# EAGLE schematic haccess (EAGLE 9.6.2)
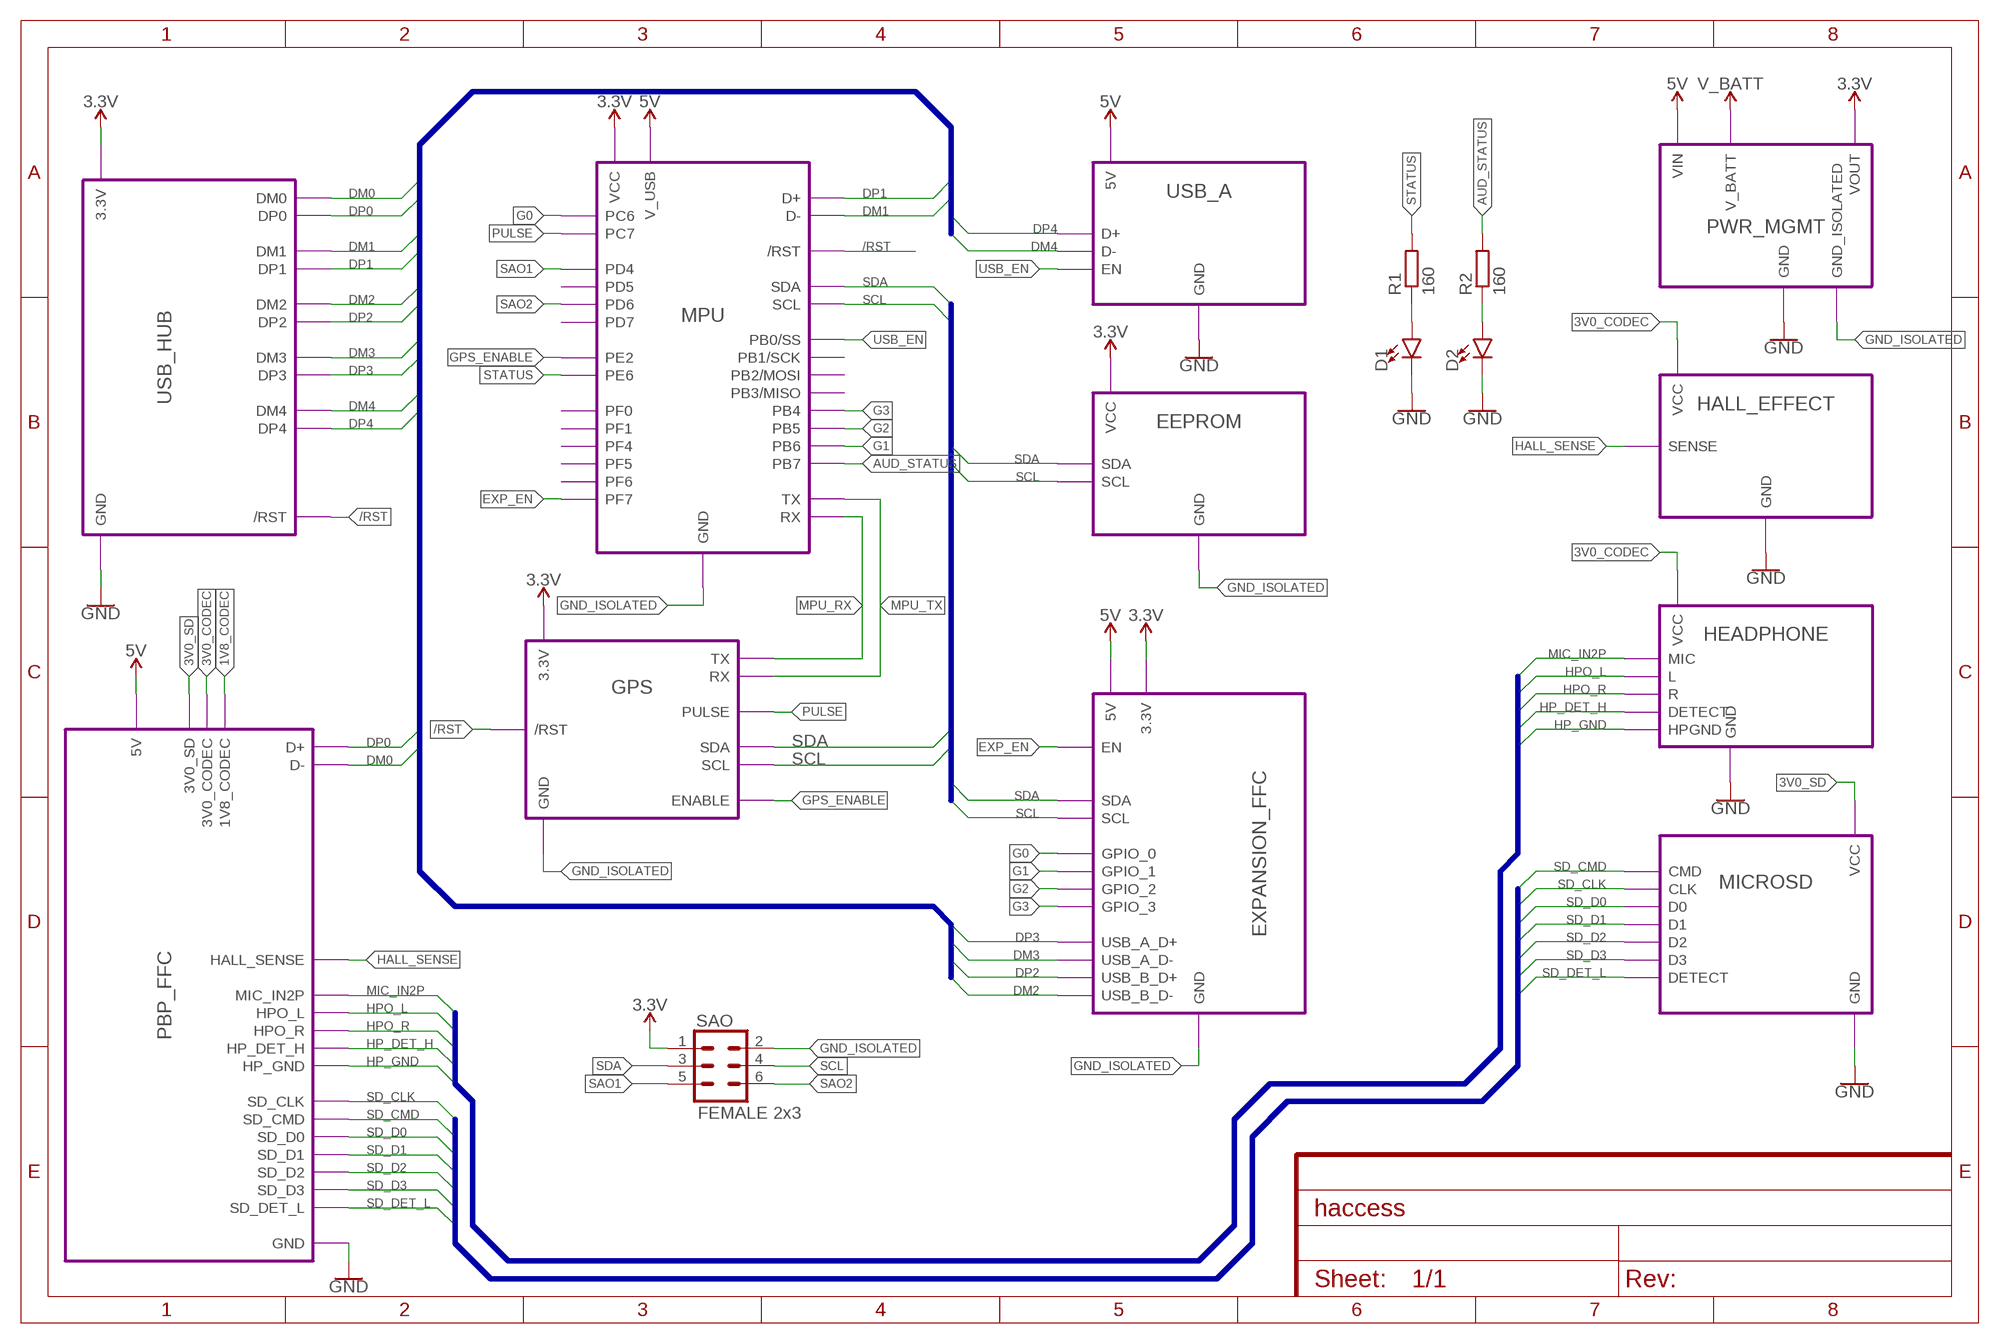
[diagram p0: schematic, sheet 1]

## Parts
D1  LED0603  [LED-0603]
D2  LED0603  [LED-0603]
R1  160  R-EU_R0603  [R0603]
R2  160  R-EU_R0603  [R0603]
SAO  FEMALE 2x3  CONN_03X2FEMALE  [2X3]

## Module instances
USB_HUB = USB_HUB
MPU = 32U4
GPS = GPS
PWR_MGMT = POWER_MANAGEMENT
PBP_FFC = PINEBOOK_PRO_FFC
MICROSD = MICROSD
HEADPHONE = HEADPHONE
HALL_EFFECT = HALL_EFFECT
EEPROM = EEPROM
USB_A = USB_A
EXPANSION_FFC = PINEBOOK_EXPANSION_FFC

## Nets
1V8_CODEC: port PBP_FFC.1V8_CODEC
3.3V: SAO.1 ; port USB_HUB.3.3V MPU.VCC PWR_MGMT.VOUT EEPROM.VCC EXPANSION_FFC.3.3V GPS.3.3V
3V0_CODEC: port PBP_FFC.3V0_CODEC HALL_EFFECT.VCC HEADPHONE.VCC
3V0_SD: port PBP_FFC.3V0_SD MICROSD.VCC
5V: port PWR_MGMT.VIN PBP_FFC.5V MPU.V_USB USB_A.5V EXPANSION_FFC.5V
/RST: port MPU./RST USB_HUB./RST GPS./RST
AUD_STATUS: R2.2 ; port MPU.PB7
DM0: port PBP_FFC.D- USB_HUB.DM0
DM1: port USB_HUB.DM1 MPU.D-
DM2: port USB_HUB.DM2 EXPANSION_FFC.USB_B_D-
DM3: port USB_HUB.DM3 EXPANSION_FFC.USB_A_D-
DM4: port USB_HUB.DM4 USB_A.D-
DP0: port PBP_FFC.D+ USB_HUB.DP0
DP1: port USB_HUB.DP1 MPU.D+
DP2: port USB_HUB.DP2 EXPANSION_FFC.USB_B_D+
DP3: port USB_HUB.DP3 EXPANSION_FFC.USB_A_D+
DP4: port USB_HUB.DP4 USB_A.D+
EXP_EN: port EXPANSION_FFC.EN MPU.PF7
G0: port EXPANSION_FFC.GPIO_0 MPU.PC6
G1: port EXPANSION_FFC.GPIO_1 MPU.PB6
G2: port EXPANSION_FFC.GPIO_2 MPU.PB5
G3: port EXPANSION_FFC.GPIO_3 MPU.PB4
GND: D1.C D2.C ; port USB_HUB.GND PWR_MGMT.GND PBP_FFC.GND MICROSD.GND HALL_EFFECT.GND HEADPHONE.GND USB_A.GND
GND_ISOLATED: SAO.2 ; port MPU.GND EXPANSION_FFC.GND PWR_MGMT.GND_ISOLATED EEPROM.GND GPS.GND
GPS_ENABLE: port GPS.ENABLE MPU.PE2
HALL_SENSE: port PBP_FFC.HALL_SENSE HALL_EFFECT.SENSE
HP_DET_H: port PBP_FFC.HP_DET_H HEADPHONE.DETECT
HP_GND: port PBP_FFC.HP_GND HEADPHONE.HPGND
HPO_L: port PBP_FFC.HPO_L HEADPHONE.L
HPO_R: port PBP_FFC.HPO_R HEADPHONE.R
MIC_IN2P: port PBP_FFC.MIC_IN2P HEADPHONE.MIC
MPU_RX: port GPS.TX MPU.RX
MPU_TX: port GPS.RX MPU.TX
N$1: D1.A R1.1
N$2: D2.A R2.1
PULSE: port GPS.PULSE MPU.PC7
SAO1: SAO.5 ; port MPU.PD4
SAO2: SAO.6 ; port MPU.PD6
SCL: SAO.4 ; port MPU.SCL EEPROM.SCL EXPANSION_FFC.SCL GPS.SCL
SD_CLK: port PBP_FFC.SD_CLK MICROSD.CLK
SD_CMD: port PBP_FFC.SD_CMD MICROSD.CMD
SD_D0: port PBP_FFC.SD_D0 MICROSD.D0
SD_D1: port PBP_FFC.SD_D1 MICROSD.D1
SD_D2: port PBP_FFC.SD_D2 MICROSD.D2
SD_D3: port PBP_FFC.SD_D3 MICROSD.D3
SD_DET_L: port PBP_FFC.SD_DET_L MICROSD.DETECT
SDA: SAO.3 ; port MPU.SDA EEPROM.SDA EXPANSION_FFC.SDA GPS.SDA
STATUS: R1.2 ; port MPU.PE6
USB_EN: port USB_A.EN MPU.PB0/SS
V_BATT: port PWR_MGMT.V_BATT

## Buses
TUSB2046_USB:DM0,DM1,DM2,DM3,DM4,DP0,DP1,DP2,DP3,DP4
EXPOSED:3.3V,5V,GND,SCL,SDA
SD:SD_CLK,SD_CMD,SD_D0,SD_D1,SD_D2,SD_D3,SD_DET_L
HP_DET_H,HP_GND,HPO_L,HPO_R,MIC_IN2P

## Library data of the parts
D1 D2 = SparkFun-LED:LED: LED (Generic) Standard schematic elements and footprints for 5mm, 3mm, 1206, and 0603 sized LEDs. Generic LEDs with no color specified.
R1 R2 = rcl:R-EU_: RESISTOR, European symbol; SPICEPREFIX: R
SAO = SparkFun-Connectors:CONN_03X2: Multi connection point. Often used as Generic Header-pin footprint for 0.1 inch spaced/style header connections You can populate with any combo of single row headers, but if you'd like an exact match, check these: Header - 2x3 (Male, 0.1") <https://www.sparkfun.com/products/12807> (PRT-12807) Header - 2x3 (Female, 0.1") <https://www.sparkfun.com/products/13010> (PRT-13010) 2x3 Pin Shrouded Header <https://www.sparkfun.com/products/10877> (PRT-10877) On any of the 0.1 inch spaced packages, you can populate with these: Break Away Headers - Straight <https://www.sparkfun.com/products/116> (PRT-00116) Break Away Male Headers - Right Angle <https://www.sparkfun.com/products/553> (PRT-00553) Female Headers <https://www.sparkfun.com/products/115> (PRT-00115) Break Away Headers - Machine Pin <https://www.sparkfun.com/products/117> (PRT-00117) Break Away Female Headers - Swiss Machine Pin <https://www.sparkfun.com/products/743> (PRT-00743) Special note: the shrouded connector mates well with our 3x2 ribbon cables: Ribbon Crimp Connector - 6-pin (2x3, Female) <https://www.sparkfun.com/products/10651> (PRT-10651) Ribbon Cable - 6 wire (15ft) <https://www.sparkfun.com/products/10646> (PRT-10646); PROD_ID: CONN-11566

## Module USBC
Ports: V_USB(pwr) GND(pwr) D+(out) D-(out)
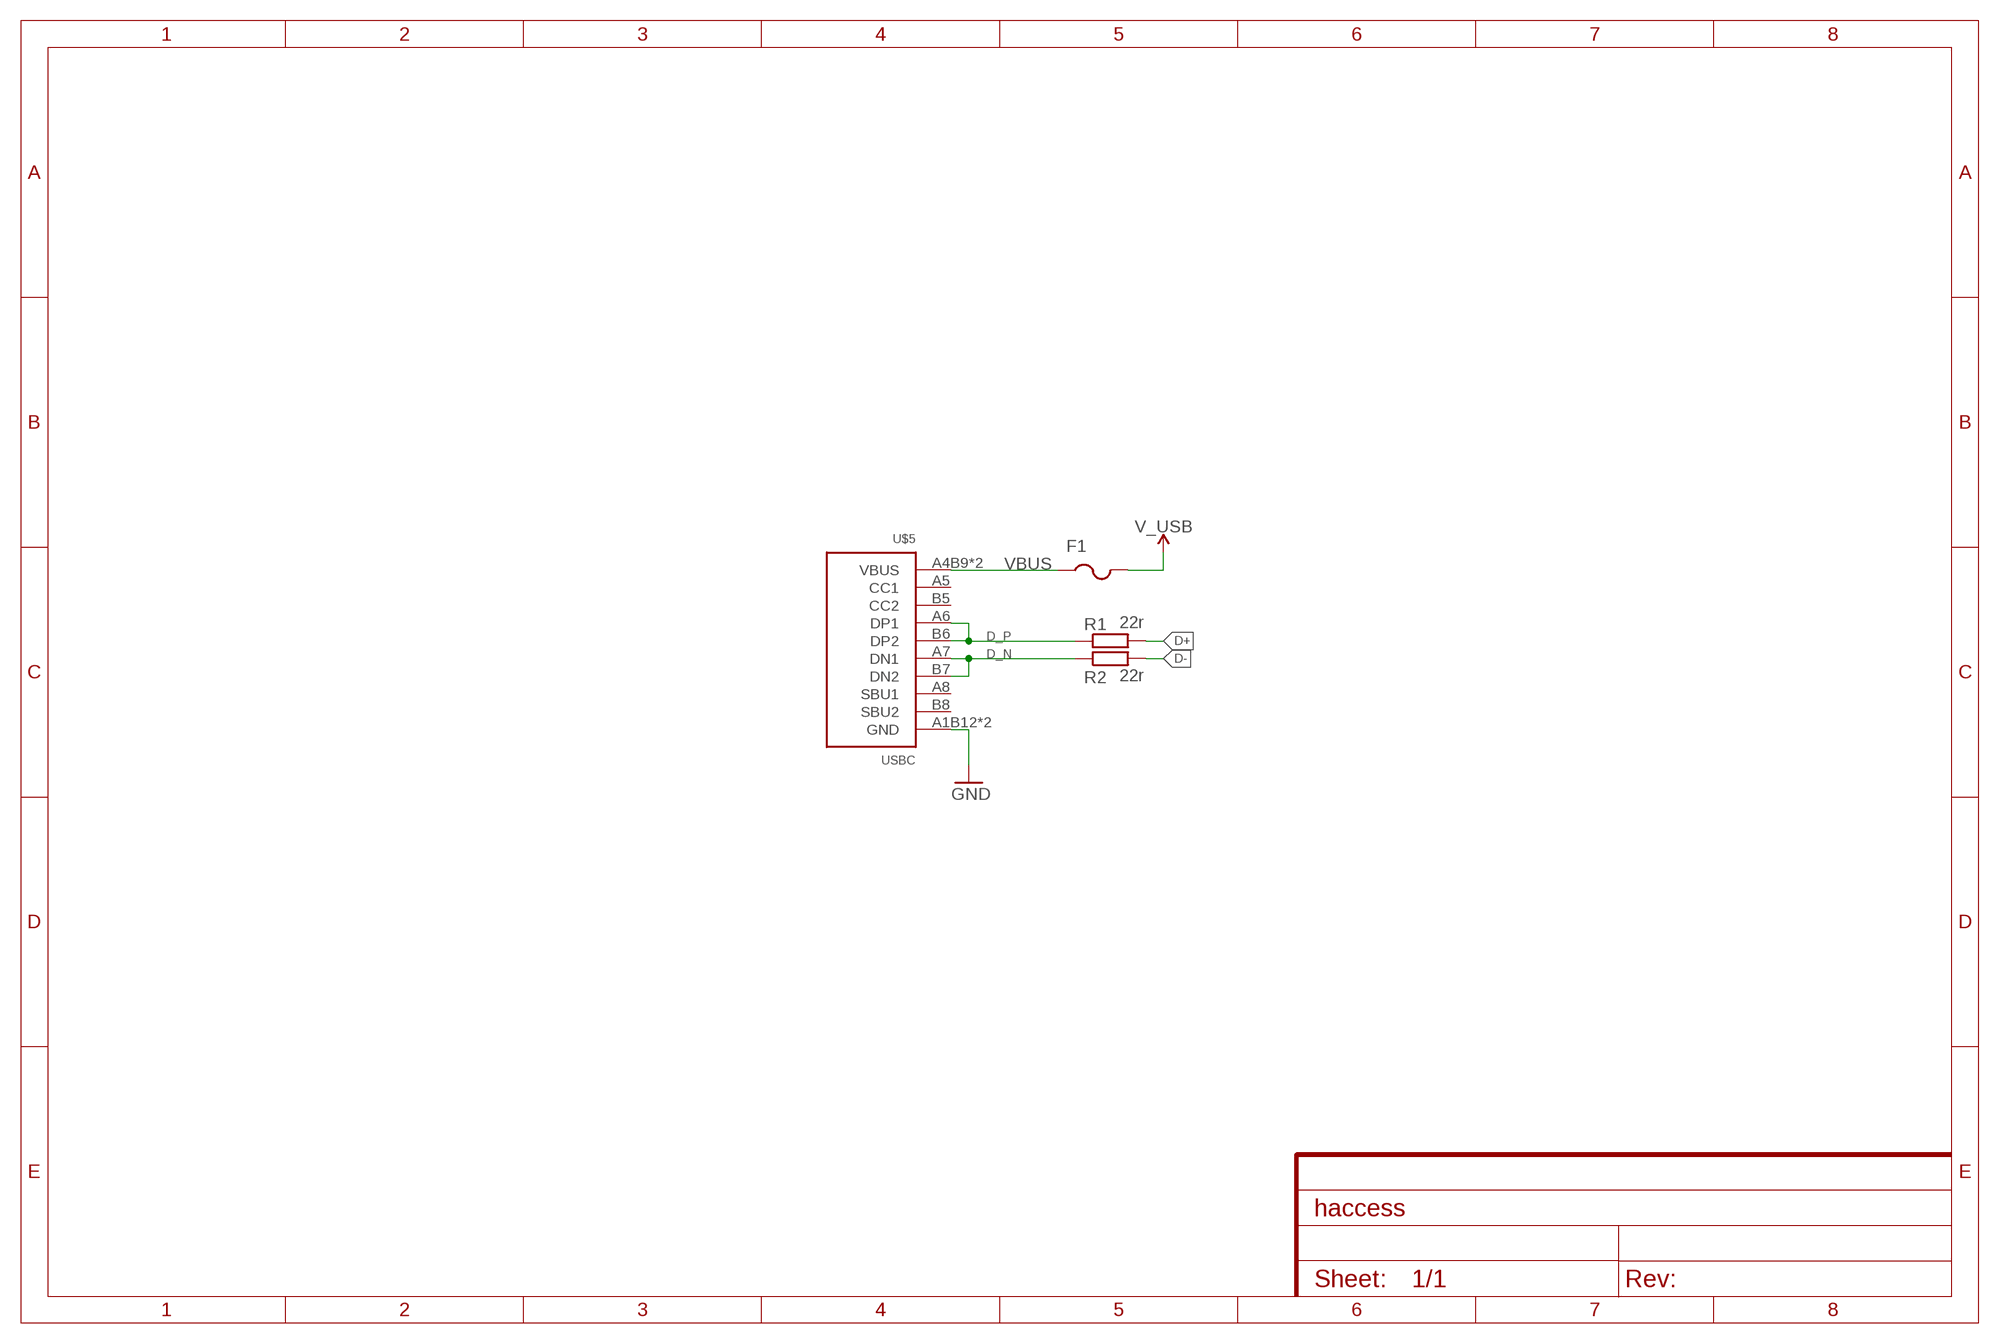
[diagram p1: schematic, module USBC, sheet 1]

### Parts
F1  PTCFUSE-1206  [R1206]
R1  22r  R-EU_R0603  [R0603]
R2  22r  R-EU_R0603  [R0603]
U$5  USBC  [USBC]

### Nets
D+: R1.2
D-: R2.2
D_N: R2.1 U$5.A7(DN1) U$5.B7(DN2)
D_P: R1.1 U$5.A6(DP1) U$5.B6(DP2)
GND [pwr]: U$5.A1B12(GND) U$5.B1A12(GND)
V_USB [pwr]: F1.2
VBUS [pwr]: F1.1 U$5.A4B9(VBUS) U$5.B4A9(VBUS)
Unconnected: U$5.A5(CC1) U$5.A8(SBU1) U$5.B5(CC2) U$5.B8(SBU2)

### Library data of the parts
F1 = adafruit:PTCFUSE: PTC fuses, resettable thermistors
R1 R2 = rcl:R-EU_: RESISTOR, European symbol; SPICEPREFIX: R
U$5 = geusebio:USBC

## Module USB_HUB
Ports: DM0(in) DP0(in) DM1(out) DP1(out) DM2(out) DP2(out) DM3(out) DP3(out) DM4(out) DP4(out) GND(pwr) 3.3V(pwr) /RST(in)
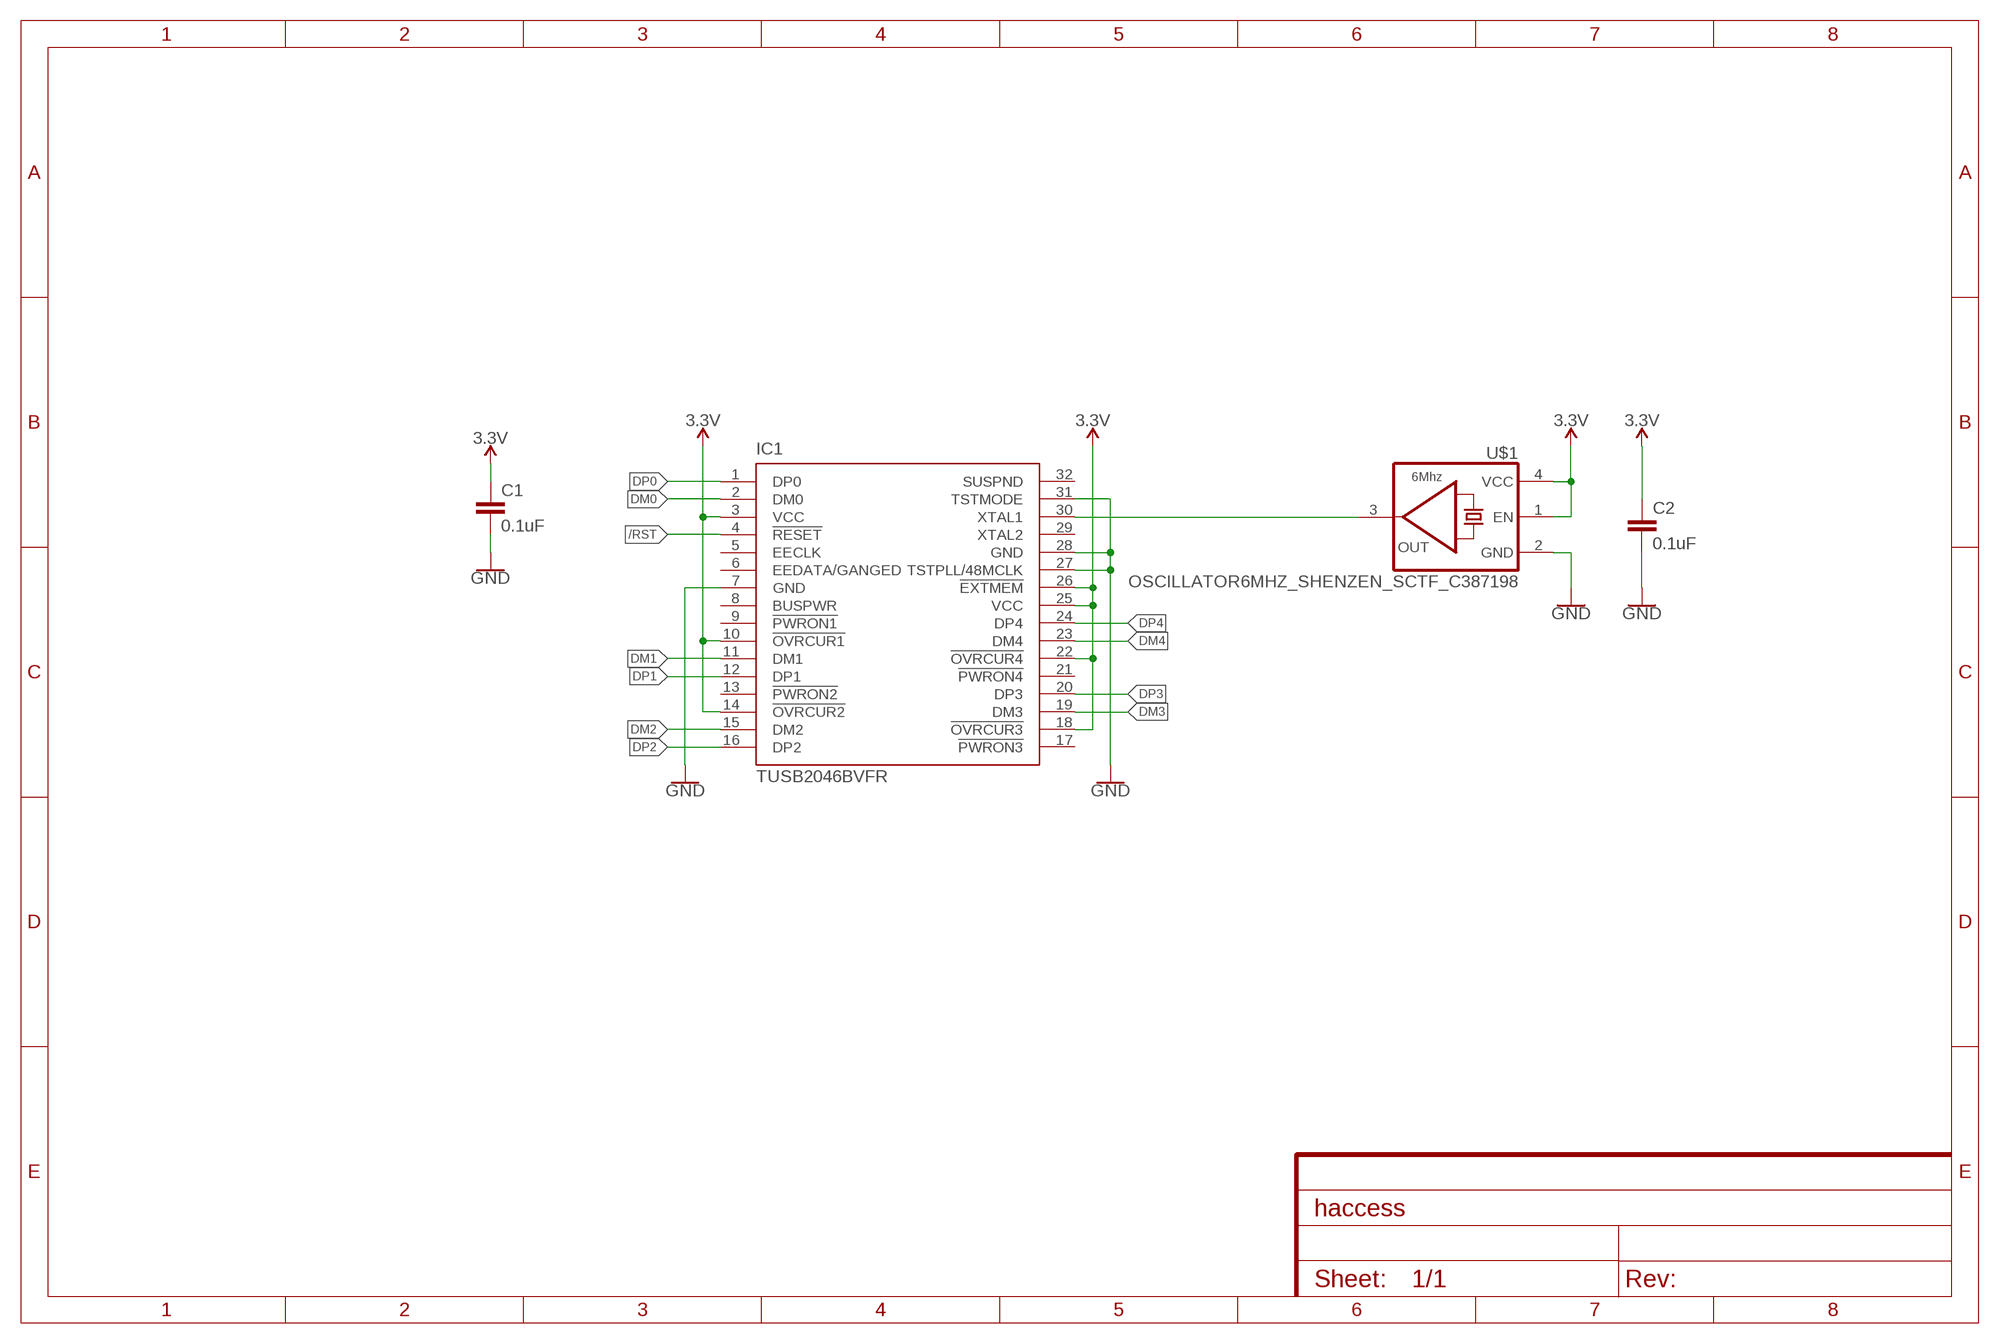
[diagram p2: schematic, module USB_HUB, sheet 1]

### Parts
C1  0.1uF  C-EUC0603  [C0603]
C2  0.1uF  C-EUC0603  [C0603]
IC1  TUSB2046BVFR  [VF_S-PQFP-G32]
U$1  OSCILLATOR6MHZ_SHENZEN_SCTF_C387198  [CRYSTAL-SMD-3.2X2.5MM]

### Nets
3.3V: C1.1 C2.1 IC1.3(VCC) IC1.10(!OVRCUR1) IC1.14(!OVRCUR2) IC1.18(!OVRCUR3) IC1.22(!OVRCUR4) IC1.25(VCC) IC1.26(!EXTMEM) U$1.1(EN) U$1.4(VCC)
/RST: IC1.4(!RESET)
DM0: IC1.2(DM0)
DM1: IC1.11(DM1)
DM2: IC1.15(DM2)
DM3: IC1.19(DM3)
DM4: IC1.23(DM4)
DP0: IC1.1(DP0)
DP1: IC1.12(DP1)
DP2: IC1.16(DP2)
DP3: IC1.20(DP3)
DP4: IC1.24(DP4)
GND [pwr]: C1.2 C2.2 IC1.7(GND) IC1.27(TSTPLL/48MCLK) IC1.28(GND) IC1.31(TSTMODE) U$1.2(GND)
N$1: IC1.30(XTAL1) U$1.3(OUT)
Unconnected: IC1.5(EECLK) IC1.6(EEDATA/GANGED) IC1.8(BUSPWR) IC1.9(!PWRON1) IC1.13(!PWRON2) IC1.17(!PWRON3) IC1.21(!PWRON4) IC1.29(XTAL2) IC1.32(SUSPND)

### Notes on the sheet
- 6Mhz

### Library data of the parts
C1 C2 = rcl:C-EU: CAPACITOR, European symbol; SPICEPREFIX: C
IC1 = texas:TUSB2046B: 4-PORT HUB FOR THE UNIVERSAL SERIAL BUS WITH OPTIONAL SERIAL EEPROM INTERFACE Auto generated by make-symbol-device-package-bsdl.ulp Rev. 30 Source: http://focus.ti.com/lit/ds/symlink/tusb2046b.pdf; MF: TEXAS INSTRUMENTS; MPN: TUSB2046BVFR; OC_FARNELL: 1470507; OC_NEWARK: 77C1806
U$1 = gone:OSCILLATOR

## Module 32U4
Ports: D+(in) D-(in) VCC(pwr) GND(pwr) /RST(in) SDA(io) SCL(out) V_USB(pwr) PB0/SS(io) PB1/SCK(io) PB2/MOSI(io) PB3/MISO(io) PB4(io) PB5(io) PB6(io) PB7(io) PC6(io) PC7(io) PD4(io) PD5(io) PD6(io) PD7(io) PE2(io) PE6(io) PF0(io) PF1(io) PF4(io) PF5(io) PF6(io) PF7(io) TX(io) RX(io)
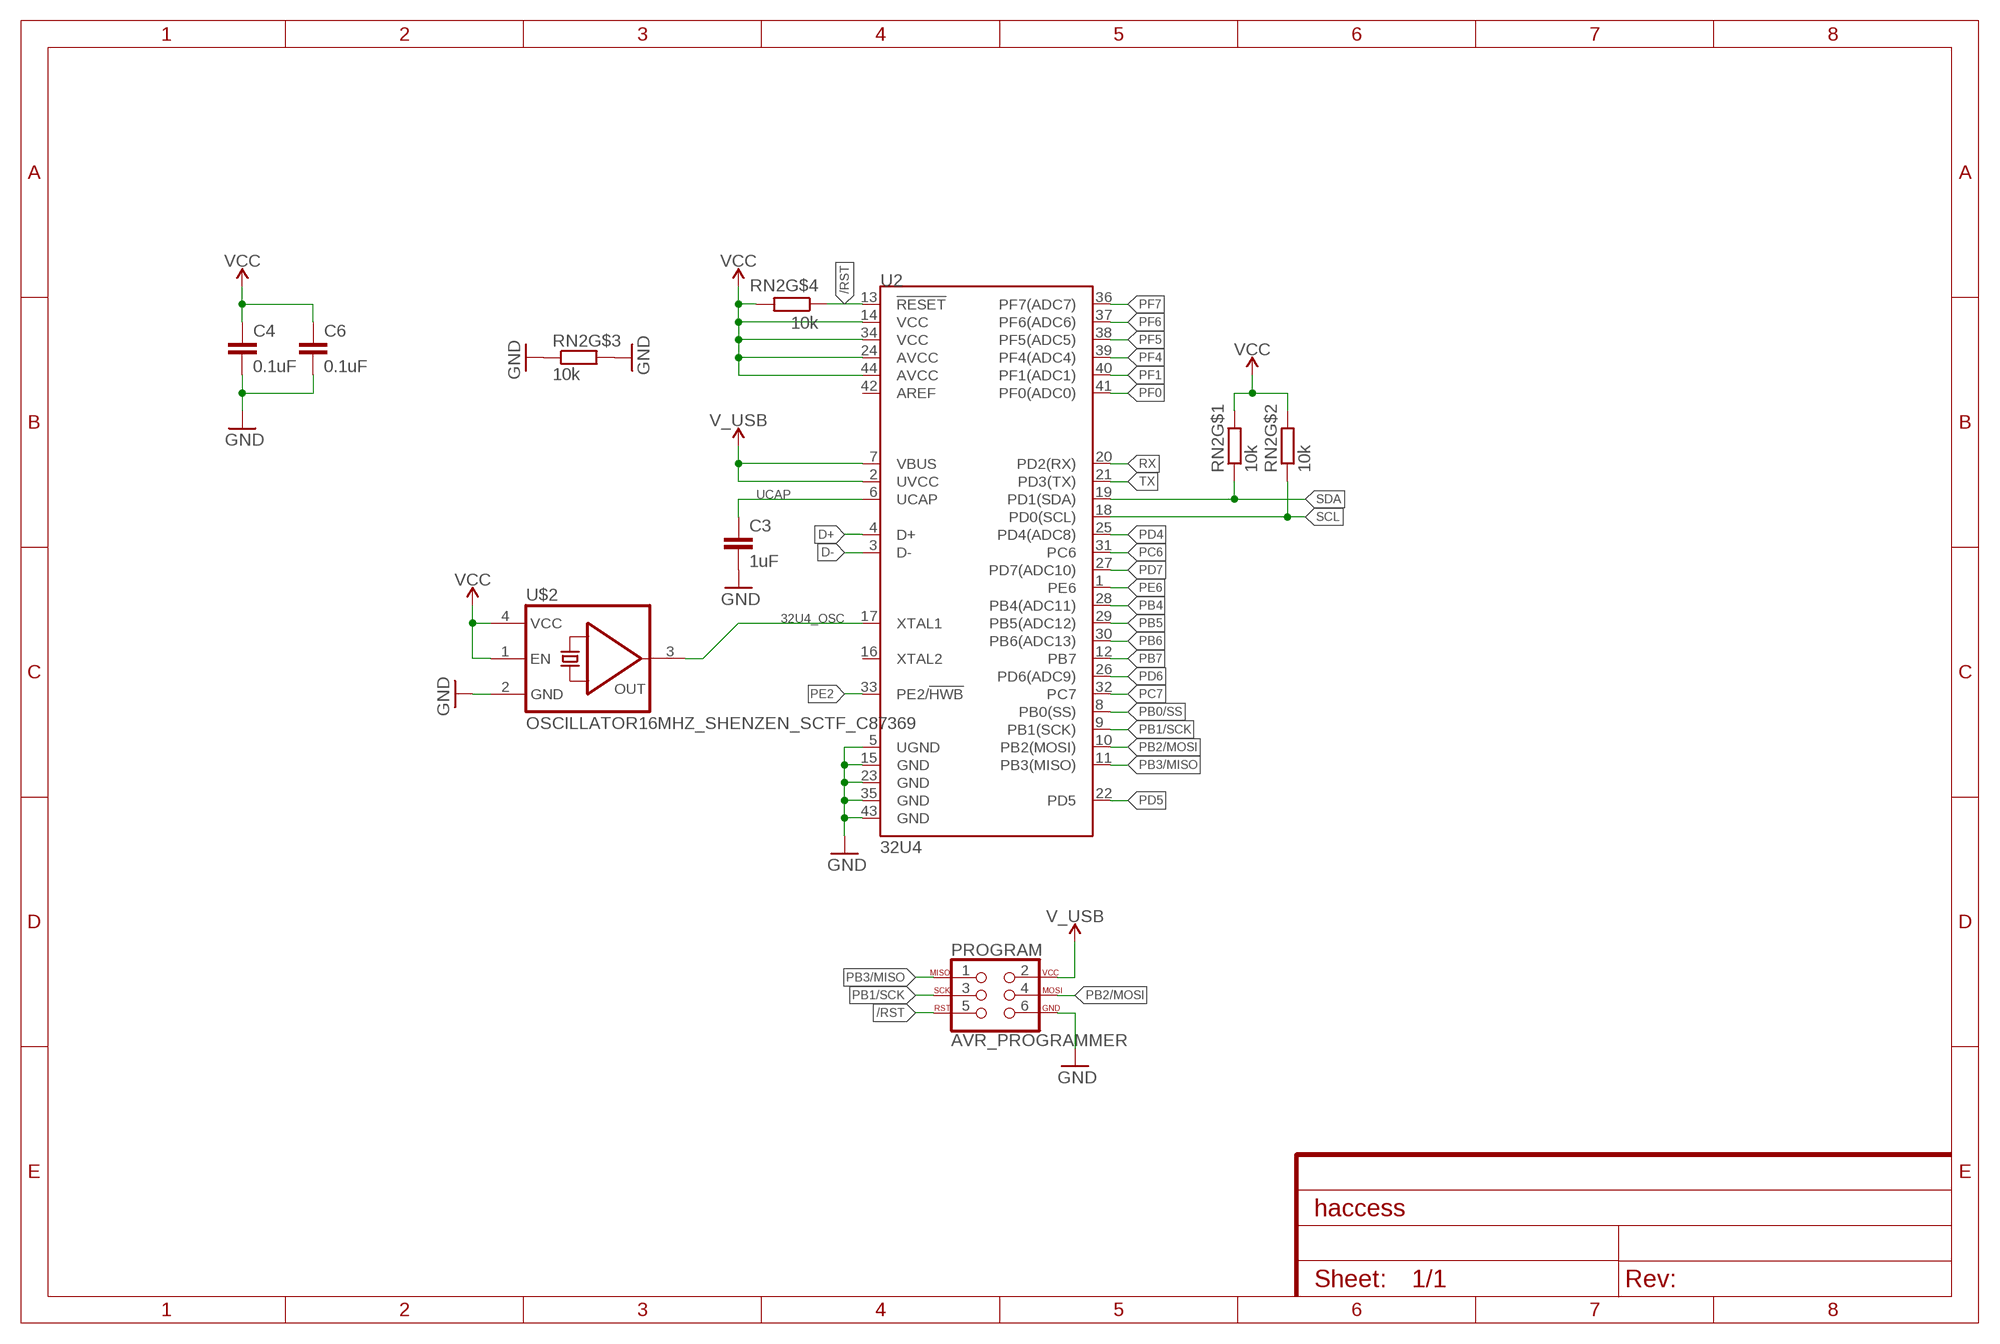
[diagram p3: schematic, module 32U4, sheet 1]

### Parts
C3  1uF  C-EUC0603  [C0603]
C4  0.1uF  C-EUC0603  [C0603]
C6  0.1uF  C-EUC0603  [C0603]
PROGRAM  AVR_PROGRAMMER  [TC2030-IDC-NL]
RN2  10k  UNIROYAL_4_WAY_RESISTOR_NETWORKUNIROYAL_0603X4  [EXBV8V]
U2  32U4  ATMEGA32U4TQFP-44  [TQFP44]
U$2  OSCILLATOR16MHZ_SHENZEN_SCTF_C87369  [CRYSTAL-SMD-3.2X2.5MM]

### Nets
32U4_OSC: U2.17(XTAL1) U$2.3(OUT)
/RST: PROGRAM.5(RST) RN2.4 U2.13(!RESET)
D+: U2.4(D+)
D-: U2.3(D-)
GND [pwr]: C3.2 C4.2 C6.2 PROGRAM.6(GND) RN2.3 RN2.6 U2.5(UGND) U2.15(GND) U2.23(GND) U2.35(GND) U2.43(GND) U$2.2(GND)
PB0/SS: U2.8(PB0(SS))
PB1/SCK: PROGRAM.3(SCK) U2.9(PB1(SCK))
PB2/MOSI: PROGRAM.4(MOSI) U2.10(PB2(MOSI))
PB3/MISO: PROGRAM.1(MISO) U2.11(PB3(MISO))
PB4: U2.28(PB4(ADC11))
PB5: U2.29(PB5(ADC12))
PB6: U2.30(PB6(ADC13))
PB7: U2.12(PB7)
PC6: U2.31(PC6)
PC7: U2.32(PC7)
PD4: U2.25(PD4(ADC8))
PD5: U2.22(PD5)
PD6: U2.26(PD6(ADC9))
PD7: U2.27(PD7(ADC10))
PE2: U2.33(PE2/!HWB)
PE6: U2.1(PE6)
PF0: U2.41(PF0(ADC0))
PF1: U2.40(PF1(ADC1))
PF4: U2.39(PF4(ADC4))
PF5: U2.38(PF5(ADC5))
PF6: U2.37(PF6(ADC6))
PF7: U2.36(PF7(ADC7))
RX: U2.20(PD2(RX))
SCL: RN2.2 U2.18(PD0(SCL))
SDA: RN2.1 U2.19(PD1(SDA))
TX: U2.21(PD3(TX))
UCAP: C3.1 U2.6(UCAP)
V_USB [pwr]: PROGRAM.2(VCC) U2.2(UVCC) U2.7(VBUS)
VCC [pwr]: C4.1 C6.1 RN2.5 RN2.7 RN2.8 U2.14(VCC) U2.24(AVCC) U2.34(VCC) U2.44(AVCC) U$2.1(EN) U$2.4(VCC)
Unconnected: U2.16(XTAL2) U2.42(AREF)

### Library data of the parts
C3 C4 C6 = rcl:C-EU: CAPACITOR, European symbol; SPICEPREFIX: C
PROGRAM = gone:AVR_PROGRAMMER
RN2 = gone:UNIROYAL_4_WAY_RESISTOR_NETWORK
U2 = SparkFun-IC-Microcontroller:ATMEGA32U4: Atmel MCU, 32KByte Atmel 44-pin 8-bit Microcontroller with 32KBytes of ISP Flash and USB Controller Datasheet <http://cdn.sparkfun.com/datasheets/Dev/Arduino/Boards/ATMega32U4.pdf> SparkFun Products LilyPad Arduino USB - ATmega32U4 Board <https://www.sparkfun.com/products/12049> (DEV-12049) Pro Micro - 5V/16MHz <https://www.sparkfun.com/products/12640> (DEV-12640) Pro Micro - 3.3V/8MHz <https://www.sparkfun.com/products/12587> (DEV-12587) Fio v3 - ATmega32U4 <https://www.sparkfun.com/products/11520> (DEV-11520) Qduino Mini <https://www.sparkfun.com/products/13614> (DEV-13614) Makey Makey - Standard Kit <https://www.sparkfun.com/products/11511> (WIG-11511) Makey Makey Deluxe Kit <https://www.sparkfun.com/products/11519> (WIG-11519); PROD_ID: IC-11161
U$2 = gone:OSCILLATOR

## Module GPS
Ports: TX(out) RX(in) PULSE(out) GND(pwr) 3.3V(pwr) SDA(io) SCL(in) ENABLE(in) /RST(in)
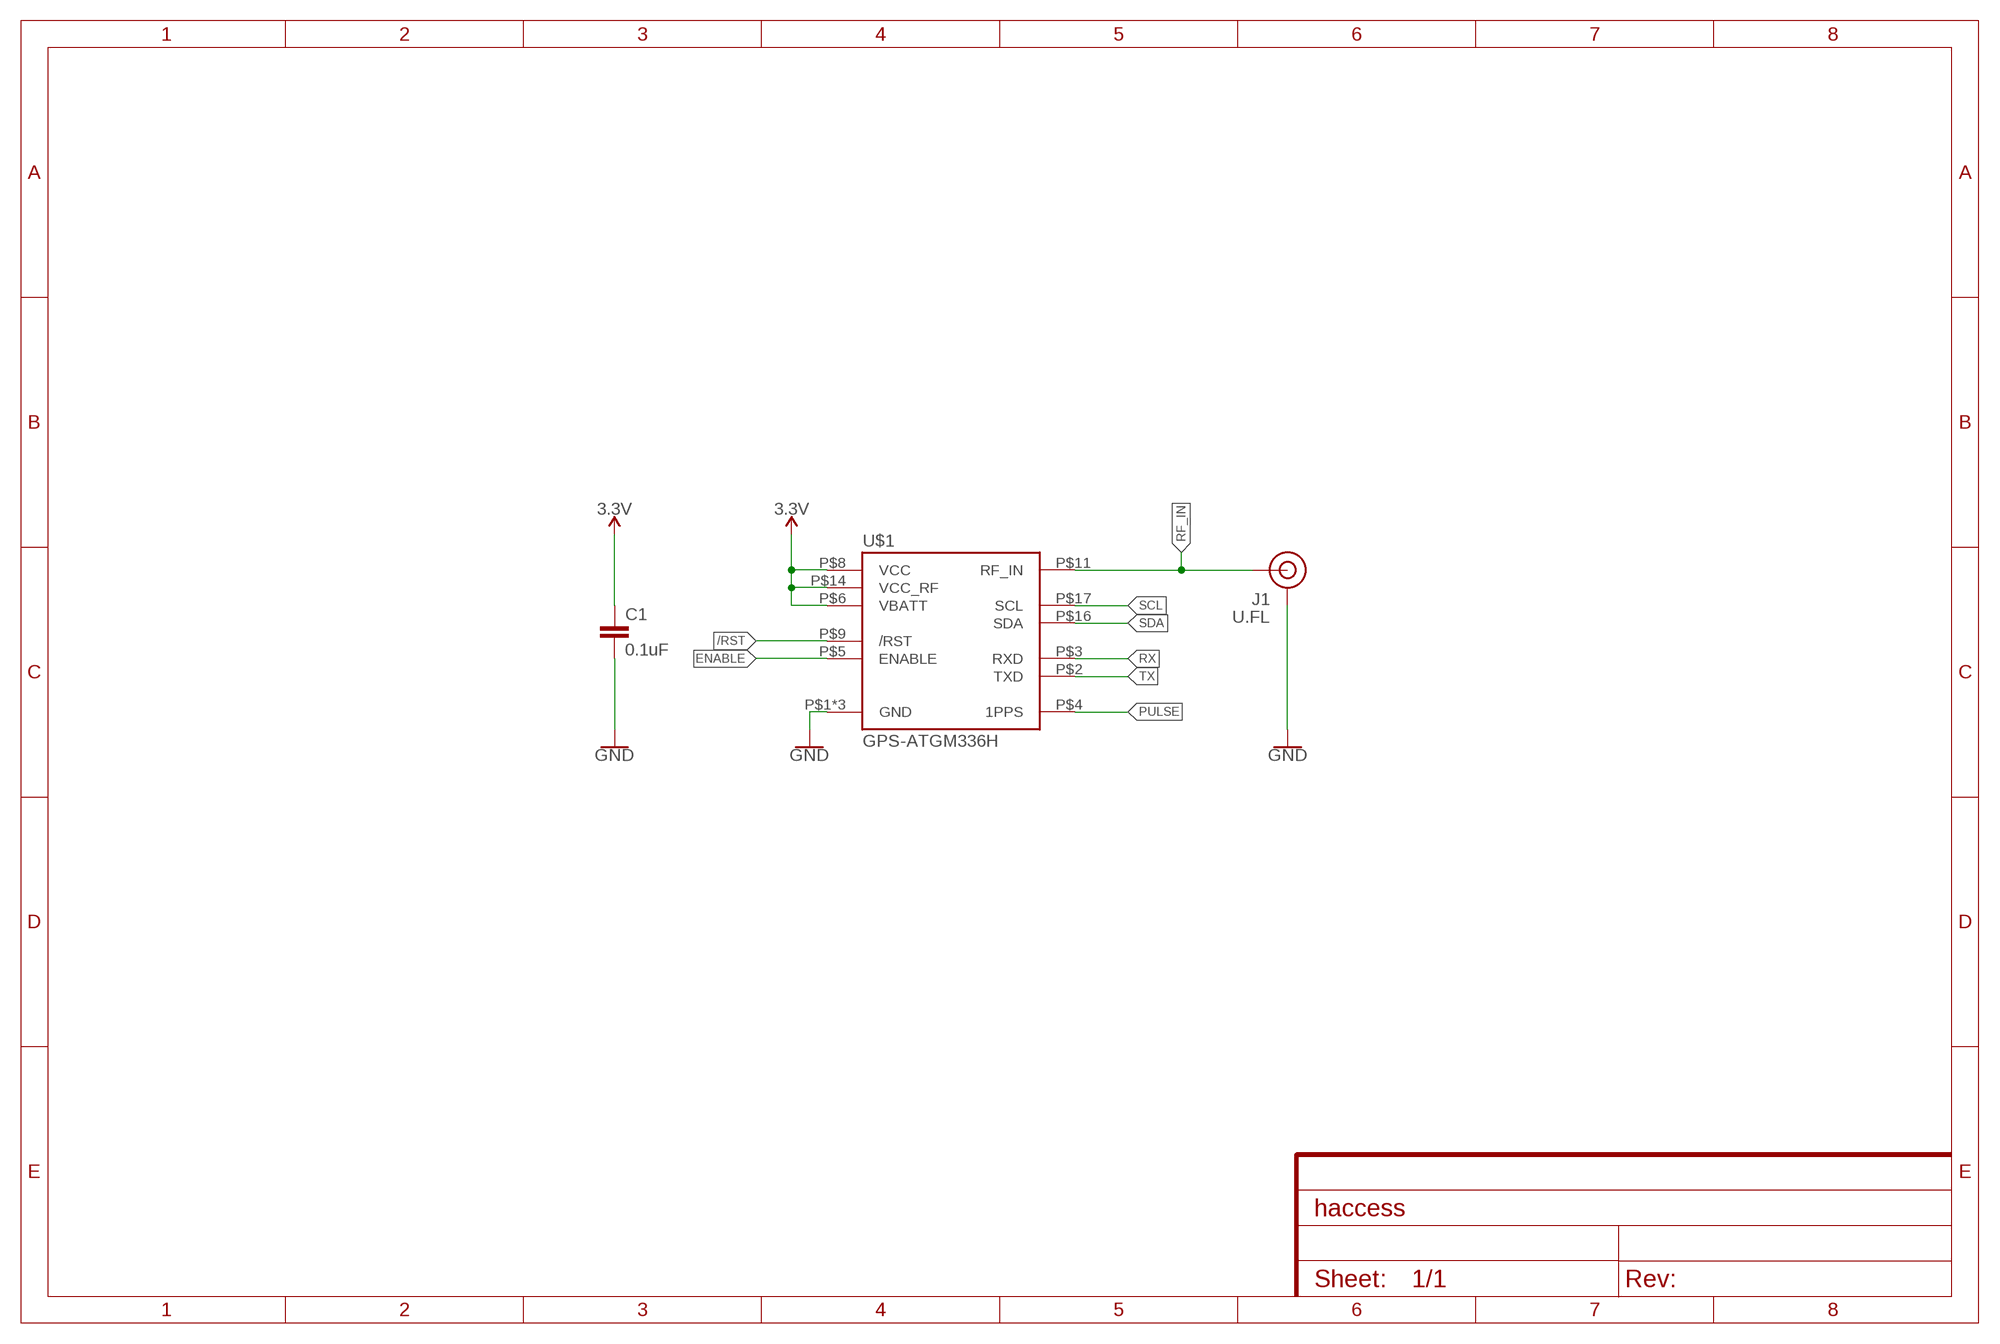
[diagram p4: schematic, module GPS, sheet 1]

### Parts
C1  0.1uF  C-EUC0603  [C0603]
J1  U.FL  U.FL2PIN  [U.FL]
U$1  GPS-ATGM336H  [ATGM336H]

### Nets
3.3V: C1.1 U$1.P$6(VBATT) U$1.P$8(VCC) U$1.P$14(VCC_RF)
/RST: U$1.P$9(/RST)
ENABLE: U$1.P$5(ENABLE)
GND: C1.2 J1.1(GND) J1.2(GND) U$1.P$1(GND) U$1.P$10(GND) U$1.P$12(GND)
PULSE: U$1.P$4(1PPS)
RF_IN: J1.FEED(SIGNAL) U$1.P$11(RF_IN)
RX: U$1.P$3(RXD)
SCL: U$1.P$17(SCL)
SDA: U$1.P$16(SDA)
TX: U$1.P$2(TXD)

### Library data of the parts
C1 = rcl:C-EU: CAPACITOR, European symbol; SPICEPREFIX: C
J1 = SparkFun-Connectors:U.FL2PIN: SMD Antenna Connector - U.FL 2mm height, 3.0mm x 3.0mm receptacle size. SparkFun Products: SparkFun WiFi Shield - ESP8266 <https://www.sparkfun.com/products/13287> SparkFun ESP8266 Thing <https://www.sparkfun.com/products/13231> SparkFun MiniGen - Pro Mini Signal Generator Shield <https://www.sparkfun.com/products/11420>; PROD_ID: CONN-09193; SF_ID: WRL-09144
U$1 = pinebook_parts:GPS-ATGM336H

## Module POWER_MANAGEMENT
Ports: GND(pwr) VIN(in) VOUT(out) V_BATT(in) GND_ISOLATED(pwr)
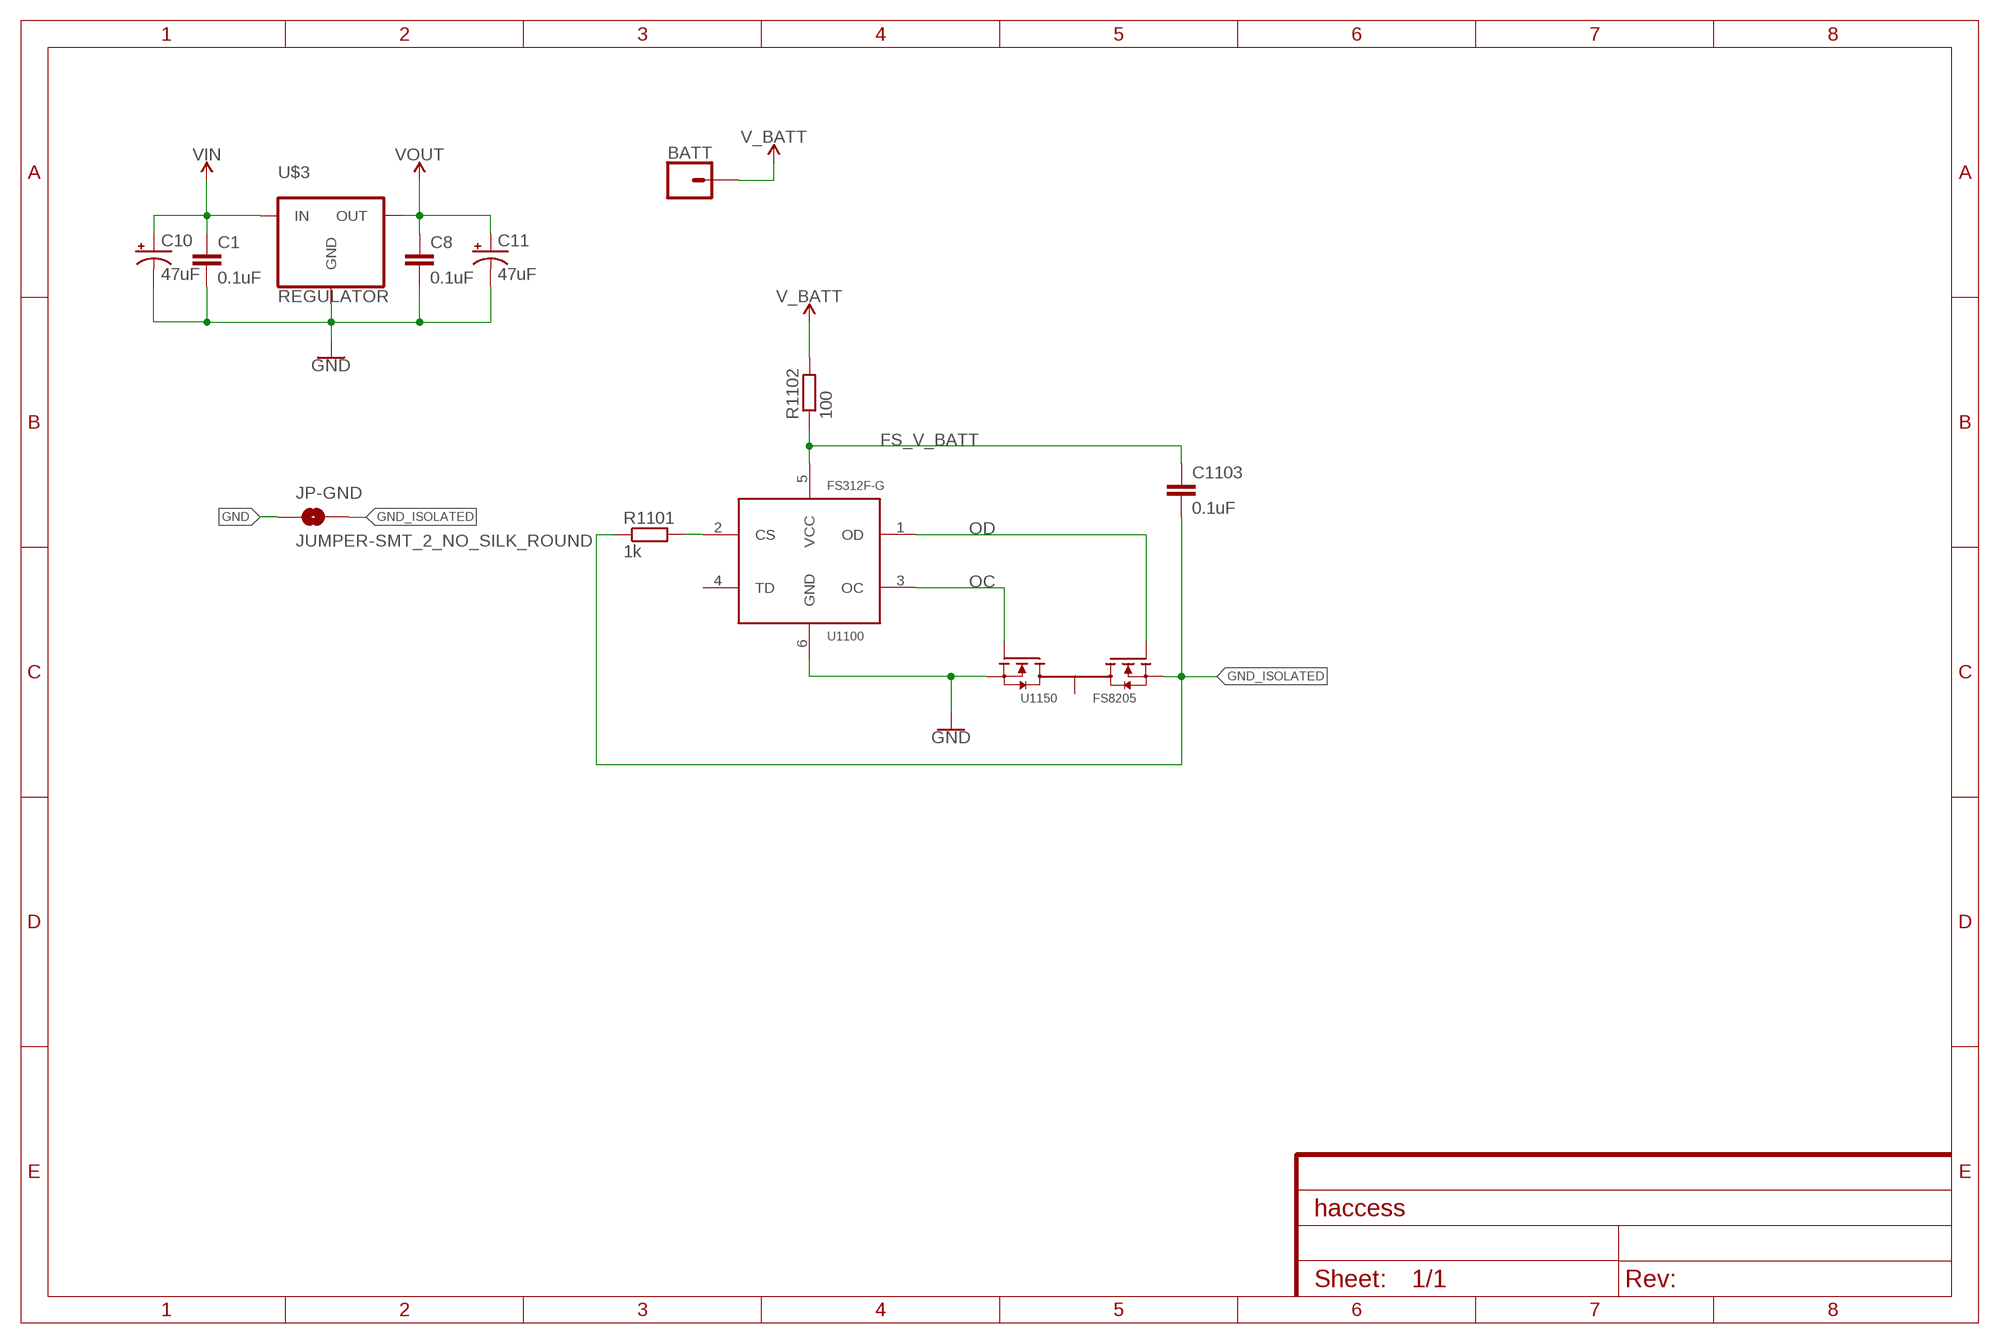
[diagram p5: schematic, module POWER_MANAGEMENT, sheet 1]

### Parts
BATT  CONN_01OFFSET  [1X01_OFFSET]
C1  0.1uF  C-EUC0603  [C0603]
C8  0.1uF  C-EUC0603  [C0603]
C10  47uF  47UF-POLAR-EIA3528-10V-10%  [EIA3528]
C11  47uF  47UF-POLAR-EIA3528-10V-10%  [EIA3528]
C1103  0.1uF  C-EUC0603  [C0603]
JP-GND  JUMPER-SMT_2_NO_SILK_ROUND  [SMT-JUMPER_2_NO_SILK_ROUND]
R1101  1k  R-EU_R0603  [R0603]
R1102  100  R-EU_R0603  [R0603]
U1100  FS312F-G  [SOT23-6]
U1150  FS8205  [SOT23-6]
U$3  REGULATOR  [SOT23-3]

### Nets
FS_CS: R1101.2 U1100.2(CS)
FS_V_BATT: C1103.1 R1102.1 U1100.5(VCC)
GND [pwr]: C1.2 C8.2 C10.C(-) C11.C(-) JP-GND.1 U1100.6(GND) U1150.1(S1) U$3.1(GND)
GND_ISOLATED: C1103.2 JP-GND.2 R1101.1 U1150.3(S2)
OC: U1100.3(OC) U1150.6(G1)
OD: U1100.1(OD) U1150.4(G2)
V_BATT: BATT.1 R1102.2
VIN [pwr]: C1.1 C10.A(+) U$3.3(IN)
VOUT: C8.1 C11.A(+) U$3.2(OUT)
Unconnected: U1100.4(TD) U1150.2(D12) U1150.5(D12)

### Library data of the parts
BATT = SparkFun-Connectors:CONN_01: Single connection point. Often used as Generic Header-pin footprint for 0.1 inch spaced/style header connections On any of the 0.1 inch spaced packages, you can populate with these: Break Away Headers - Straight <https://www.sparkfun.com/products/116> (PRT-00116) Break Away Male Headers - Right Angle <https://www.sparkfun.com/products/553> (PRT-00553) Female Headers <https://www.sparkfun.com/products/115> (PRT-00115) Break Away Headers - Machine Pin <https://www.sparkfun.com/products/117> (PRT-00117) Break Away Female Headers - Swiss Machine Pin <https://www.sparkfun.com/products/743> (PRT-00743) This device is also useful as a general connection point to wire up your design to another part of your project. Our various solder wires solder well into these plated through hole pads. Hook-Up Wire - Assortment (Stranded, 22 AWG) <https://www.sparkfun.com/products/11375> (PRT-11375) Hook-Up Wire - Assortment (Solid Core, 22 AWG) <https://www.sparkfun.com/products/11367> (PRT-11367) View the entire wire category on our website here <https://www.sparkfun.com/categories/141> Special notes: SMTSO-256-ET is a "flush mount" nut for a 4-40 screw. We mostly use this on specialty testbeds; it is a nice way to connect hardware to your PCB at an adjustable hieght. Also note, the SNAP packages are for using a snappable style connector. We sell a baggie of snaps and they are also used on two LilyPad designs: Snap Assortment - 30 pack (male and female) <https://www.sparkfun.com/products/11347> (DEV-11347) LilyPad Arduino SimpleSnap <https://www.sparkfun.com/products/10941> (DEV-10941) LilyPad SimpleSnap Protoboard <https://www.sparkfun.com/products/10940> (DEV-10940)
C1 C8 C1103 = rcl:C-EU: CAPACITOR, European symbol; SPICEPREFIX: C
C10 C11 = SparkFun-Capacitors:47UF-POLAR: 47µF polarized capacitors A capacitor is a passive two-terminal electrical component used to store electrical energy temporarily in an electric field.; PROD_ID: CAP-08310
JP-GND = SparkFun-Jumpers:JUMPER-SMT_2_NO: Normally open jumper This jumper has two pads in close proximity to each other. Apply solder to close the connection. Round pads are easier to solder for beginners, but are a lot larger. SparkFun Product that uses the round pads: SparkFun EL Sequencer <https://www.sparkfun.com/products/12781>
R1101 R1102 = rcl:R-EU_: RESISTOR, European symbol; SPICEPREFIX: R
U1100 = geusebio:FS312F-G
U1150 = geusebio:FS8205
U$3 = gone:REGULATOR

## Module PINEBOOK_PRO_FFC
Ports: D+(io) D-(io) GND(pwr) 5V(pwr) 3V0_SD(pwr) 3V0_CODEC(pwr) 1V8_CODEC(pwr) SD_D0(io) SD_DET_L(in) SD_D3(io) SD_D2(io) SD_D1(io) SD_CMD(io) SD_CLK(out) HPO_L(out) HPO_R(out) HP_DET_H(in) HP_GND(pwr) MIC_IN2P(in) HALL_SENSE(in)
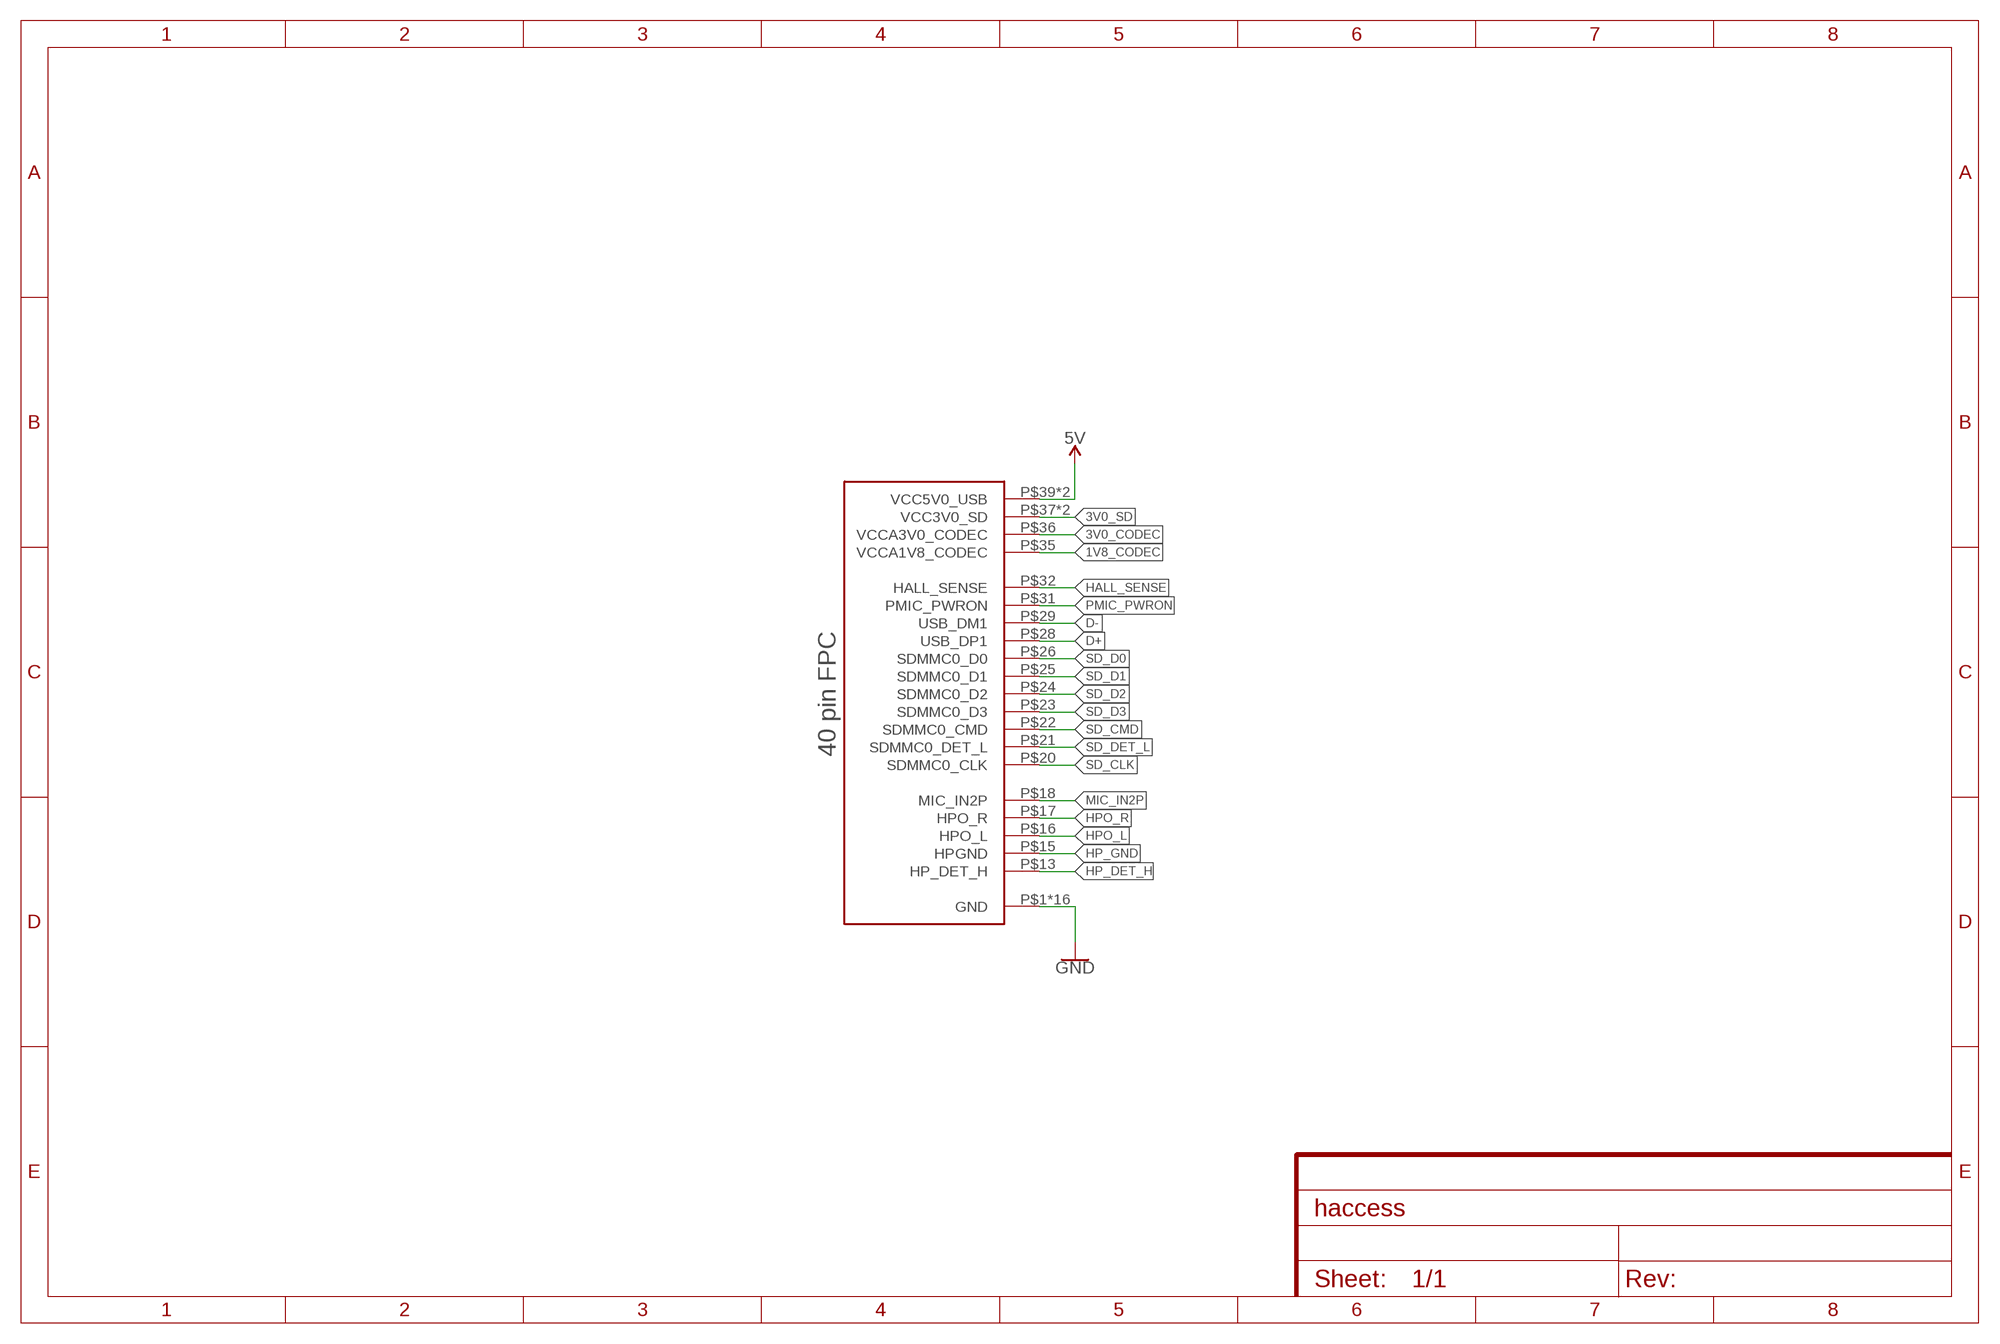
[diagram p6: schematic, module PINEBOOK_PRO_FFC, sheet 1]

### Parts
J2  PINEBOOK-PRO-DAUGHTERBOARD-CONNECTOR  [FPC05040-17204]

### Nets
1V8_CODEC: J2.P$35(VCCA1V8_CODEC)
3V0_CODEC: J2.P$36(VCCA3V0_CODEC)
3V0_SD: J2.P$37(VCC3V0_SD) J2.P$38(VCC3V0_SD)
5V: J2.P$39(VCC5V0_USB) J2.P$40(VCC5V0_USB)
D+: J2.P$28(USB_DP1)
D-: J2.P$29(USB_DM1)
GND: J2.P$1(GND) J2.P$2(GND) J2.P$3(GND) J2.P$4(GND) J2.P$5(GND) J2.P$6(GND) J2.P$9(GND) J2.P$10(GND) J2.P$11(GND) J2.P$12(GND) J2.P$14(GND) J2.P$19(GND) J2.P$27(GND) J2.P$30(GND) J2.P$41(GND) J2.P$42(GND)
HALL_SENSE: J2.P$32(HALL_SENSE)
HP_DET_H: J2.P$13(HP_DET_H)
HP_GND: J2.P$15(HPGND)
HPO_L: J2.P$16(HPO_L)
HPO_R: J2.P$17(HPO_R)
MIC_IN2P: J2.P$18(MIC_IN2P)
PMIC_PWRON: J2.P$31(PMIC_PWRON)
SD_CLK: J2.P$20(SDMMC0_CLK)
SD_CMD: J2.P$22(SDMMC0_CMD)
SD_D0: J2.P$26(SDMMC0_D0)
SD_D1: J2.P$25(SDMMC0_D1)
SD_D2: J2.P$24(SDMMC0_D2)
SD_D3: J2.P$23(SDMMC0_D3)
SD_DET_L: J2.P$21(SDMMC0_DET_L)

### Library data of the parts
J2 = pinebook_parts:PINEBOOK-PRO-DAUGHTERBOARD-CONNECTOR: Multi connection point. Often used as Generic Header-pin footprint for 0.1 inch spaced/style header connections On any of the 0.1 inch spaced packages, you can populate with these: Break Away Headers - Straight <https://www.sparkfun.com/products/116> (PRT-00116) Break Away Male Headers - Right Angle <https://www.sparkfun.com/products/553> (PRT-00553) Female Headers <https://www.sparkfun.com/products/115> (PRT-00115) Break Away Headers - Machine Pin <https://www.sparkfun.com/products/117> (PRT-00117) Break Away Female Headers - Swiss Machine Pin <https://www.sparkfun.com/products/743> (PRT-00743) For SCREWTERMINALS and SPRING TERMINALS visit here: Screw Terimnals on SparkFun.com <https://www.sparkfun.com/search/results?term=Screw+Terminals> (5mm/3.5mm/2.54mm spacing) This device is also useful as a general connection point to wire up your design to another part of your project. Our various solder wires solder well into these plated through hole pads. Hook-Up Wire - Assortment (Stranded, 22 AWG) <https://www.sparkfun.com/products/11375> (PRT-11375) Hook-Up Wire - Assortment (Solid Core, 22 AWG) <https://www.sparkfun.com/products/11367> (PRT-11367) View the entire wire category on our website here <https://www.sparkfun.com/categories/141> Special notes: Molex polarized connector foot print use with SKU : PRT-08231 with associated crimp pins and housings. 1MM SMD Version SKU: PRT-10208 NOTES ON THE VARIANTS LOCK and LOCK_LONGPADS... This footprint was designed to help hold the alignment of a through-hole component (i.e. 6-pin header) while soldering it into place. You may notice that each hole has been shifted either up or down by 0.005 of an inch from it's more standard position (which is a perfectly straight line). This slight alteration caused the pins (the squares in the middle) to touch the edges of the holes. Because they are alternating, it causes a "brace" to hold the component in place. 0.005 has proven to be the perfect amount of "off-center" position when using our standard breakaway headers. Although looks a little odd when you look at the bare footprint, once you have a header in there, the alteration is very hard to notice. Also,if you push a header all the way into place, it is covered up entirely on the bottom side.

## Module MICROSD
Ports: VCC(pwr) GND(pwr) CMD(in) CLK(in) D0(io) D1(io) D2(io) D3(io) DETECT(out)
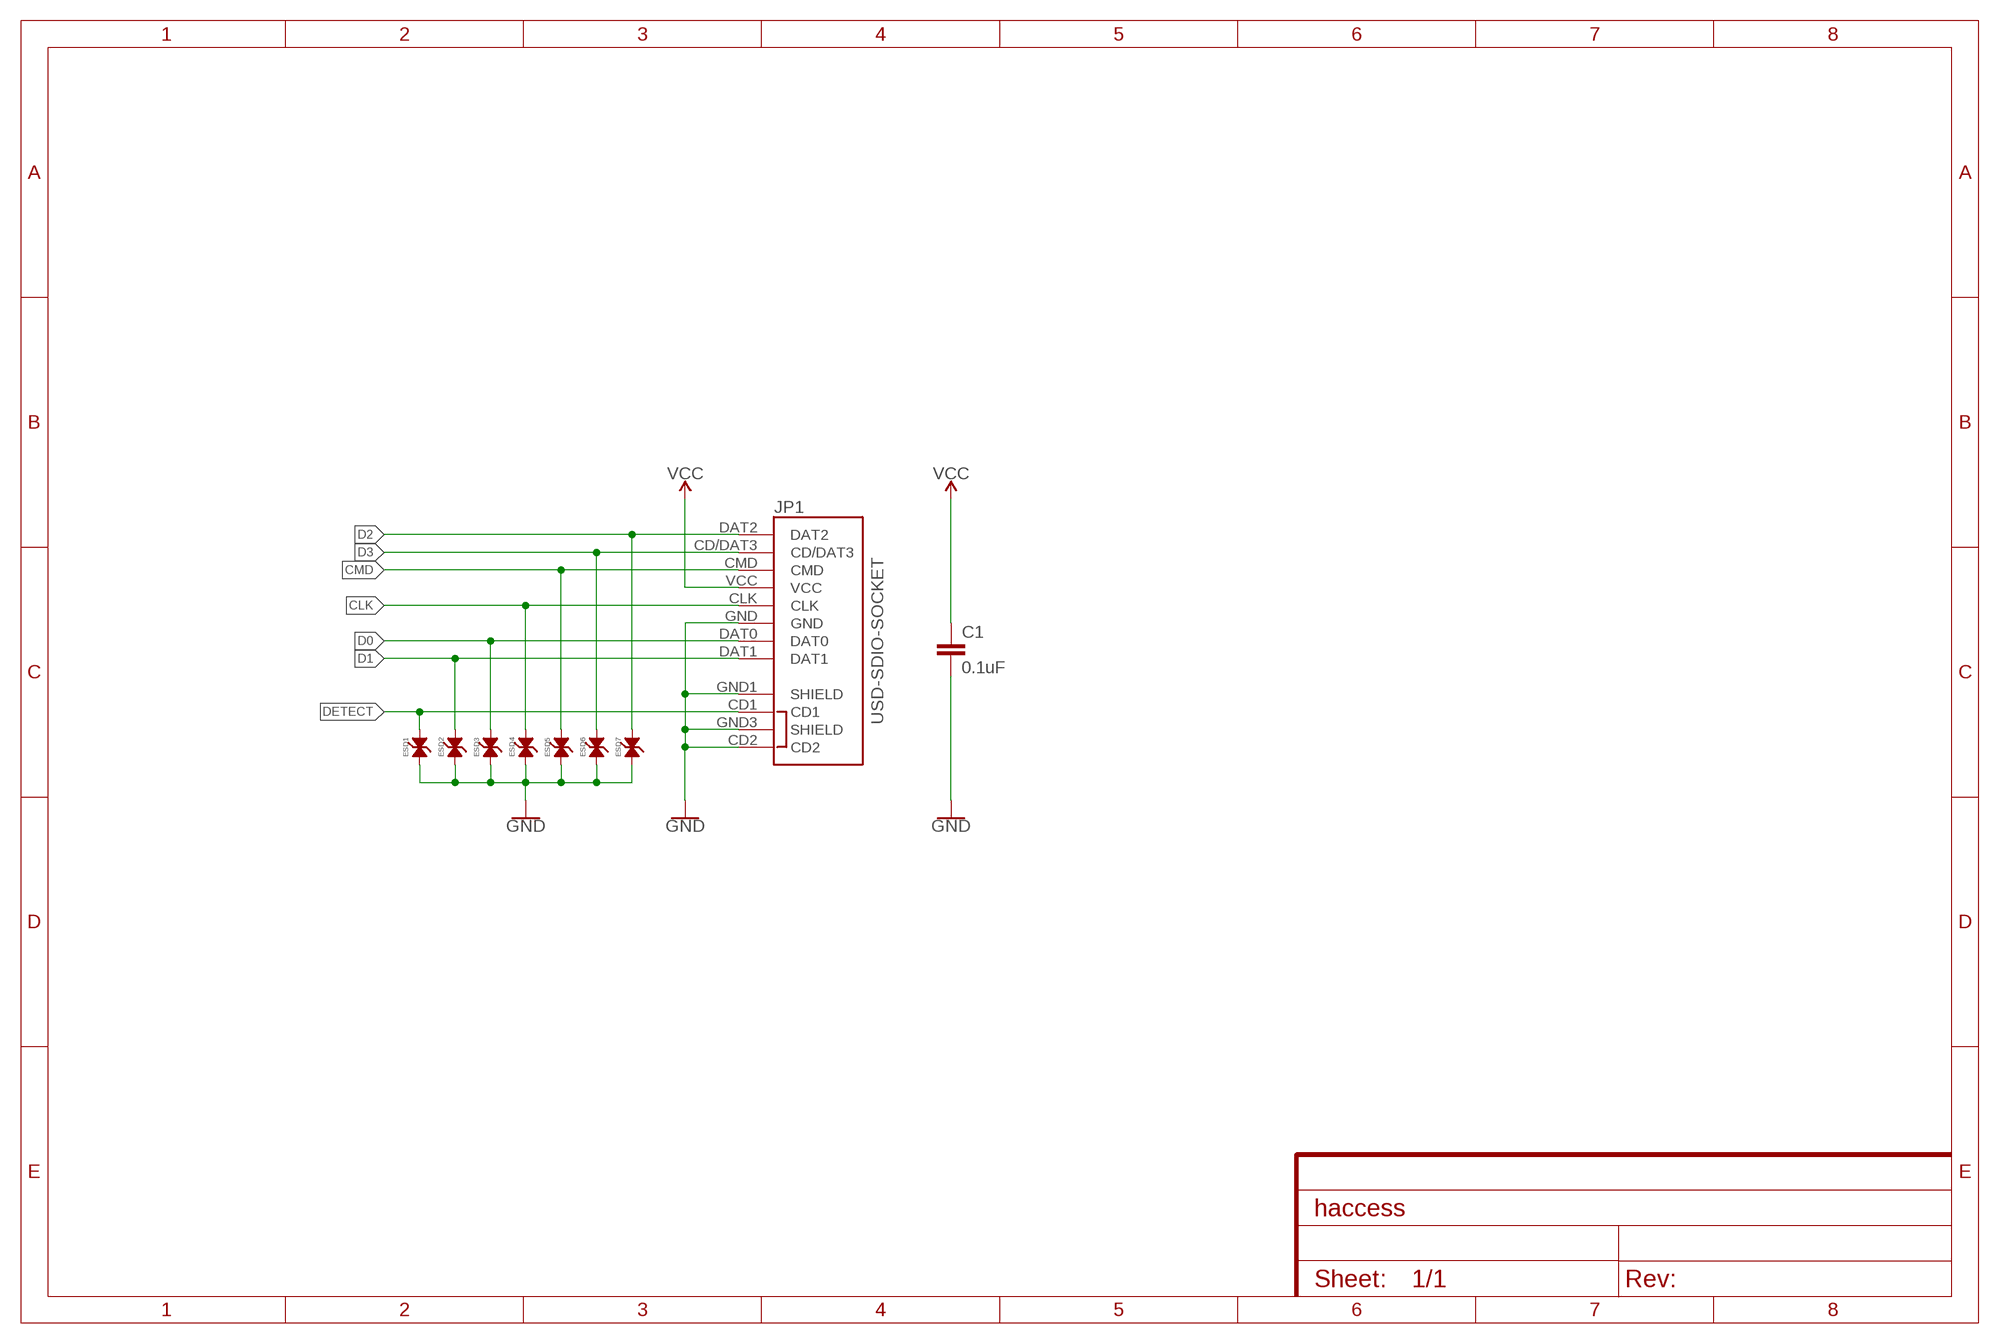
[diagram p7: schematic, module MICROSD, sheet 1]

### Parts
C1  0.1uF  C-EUC0603  [C0603]
ESD1  DIODE_ESDUAD03C05L01  [DFN1608]
ESD2  DIODE_ESDUAD03C05L01  [DFN1608]
ESD3  DIODE_ESDUAD03C05L01  [DFN1608]
ESD4  DIODE_ESDUAD03C05L01  [DFN1608]
ESD5  DIODE_ESDUAD03C05L01  [DFN1608]
ESD6  DIODE_ESDUAD03C05L01  [DFN1608]
ESD7  DIODE_ESDUAD03C05L01  [DFN1608]
JP1  USD-SDIO-SOCKET  [MICRO-SD-SOCKET-SDIO]

### Nets
CLK: ESD4.P$2 JP1.CLK
CMD: ESD5.P$2 JP1.CMD
D0: ESD3.P$2 JP1.DAT0
D1: ESD2.P$2 JP1.DAT1
D2: ESD7.P$2 JP1.DAT2
D3: ESD6.P$2 JP1.CD/DAT3
DETECT: ESD1.P$2 JP1.CD1
GND: C1.2 ESD1.P$1 ESD2.P$1 ESD3.P$1 ESD4.P$1 ESD5.P$1 ESD6.P$1 ESD7.P$1 JP1.CD2 JP1.GND JP1.GND1(SHIELD) JP1.GND3(SHIELD)
VCC: C1.1 JP1.VCC

### Library data of the parts
C1 = rcl:C-EU: CAPACITOR, European symbol; SPICEPREFIX: C
ESD1-ESD7 = pinebook_parts:DIODE_ESD
JP1 = SparkFun-Retired:USD-SDIO-SOCKET: microSD Socket Push-push type uSD socket with full SDIO signal mapping. Spark Fun Electronics SKU : PRT-00127. tDoc lines correctly indicate media card edge positions when inserting (unlocked, locked, depressed). NOTE: CD1 and CD2 are connected internally, and short to ground when card is removed.; PROD_ID: CONN-07820

## Module HEADPHONE
Ports: HPGND(pwr) DETECT(out) R(in) L(in) MIC(out) VCC(pwr) GND(pwr)
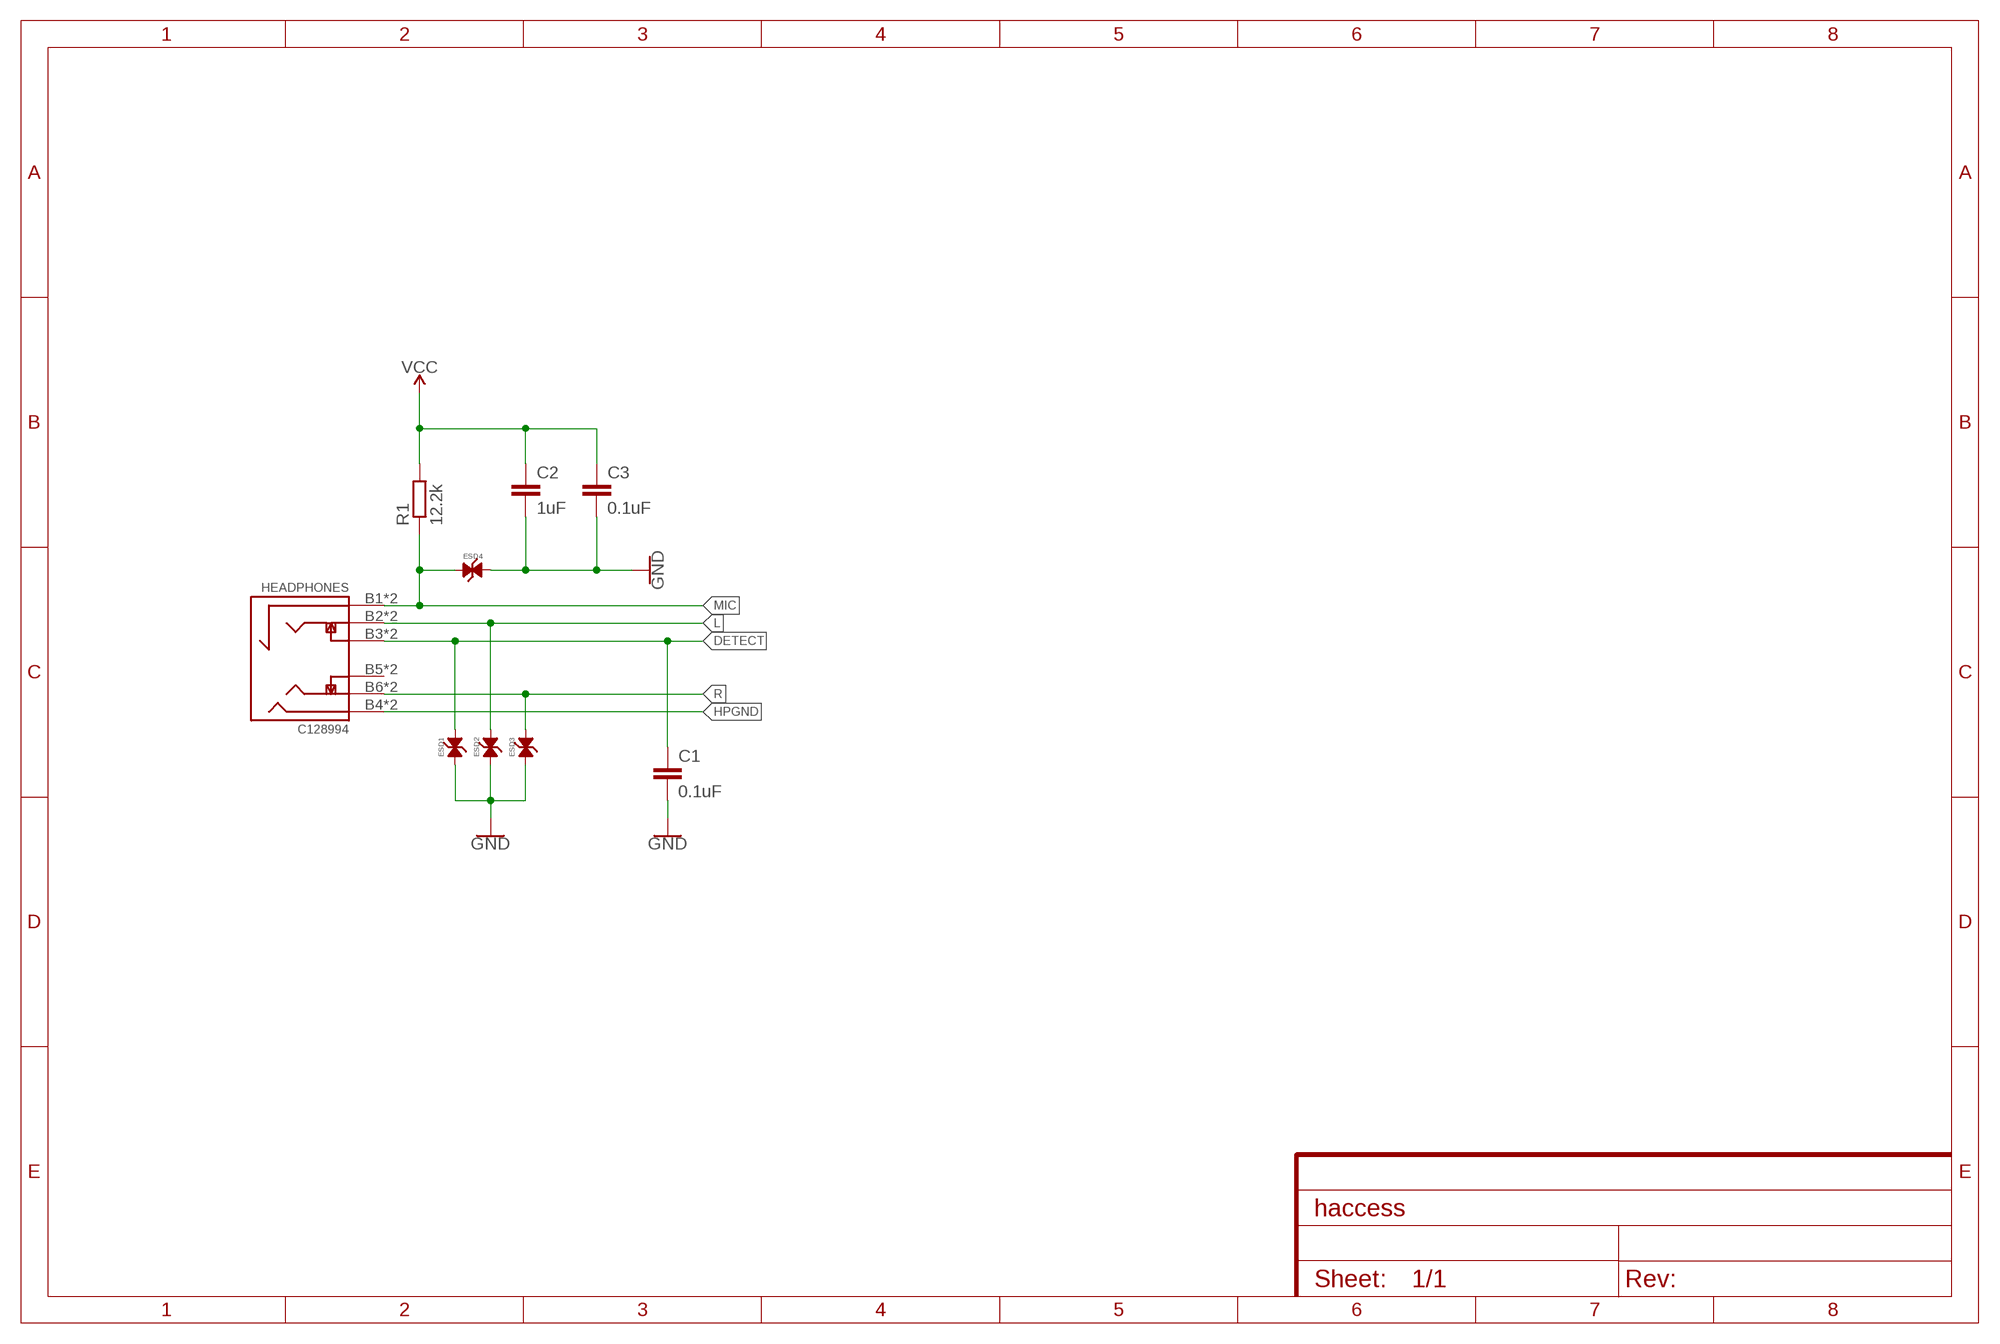
[diagram p8: schematic, module HEADPHONE, sheet 1]

### Parts
C1  0.1uF  C-EUC0603  [C0603]
C2  1uF  C-EUC0603  [C0603]
C3  0.1uF  C-EUC0603  [C0603]
ESD1  DIODE_ESDUAD03C05L01  [DFN1608]
ESD2  DIODE_ESDUAD03C05L01  [DFN1608]
ESD3  DIODE_ESDUAD03C05L01  [DFN1608]
ESD4  DIODE_ESDUAD03C05L01  [DFN1608]
HEADPHONES  C128994  AUDIO_JACK_C128994  [AUDIO_JACK_C128994]
R1  12.2k  R-EU_R0603  [R0603]

### Nets
DETECT: C1.1 ESD1.P$2 HEADPHONES.B3 HEADPHONES.T3
GND: C1.2 C2.2 C3.2 ESD1.P$1 ESD2.P$1 ESD3.P$1 ESD4.P$1
HPGND: HEADPHONES.B4 HEADPHONES.T4
L: ESD2.P$2 HEADPHONES.B2 HEADPHONES.T2
MIC: ESD4.P$2 HEADPHONES.B1 HEADPHONES.T1 R1.1
R: ESD3.P$2 HEADPHONES.B6 HEADPHONES.T6
VCC: C2.1 C3.1 R1.2
Unconnected: HEADPHONES.B5 HEADPHONES.T5

### Library data of the parts
C1-C3 = rcl:C-EU: CAPACITOR, European symbol; SPICEPREFIX: C
ESD1-ESD4 = pinebook_parts:DIODE_ESD
HEADPHONES = pinebook_parts:AUDIO_JACK_C128994
R1 = rcl:R-EU_: RESISTOR, European symbol; SPICEPREFIX: R

## Module HALL_EFFECT
Ports: VCC(pwr) GND(pwr) SENSE(out)
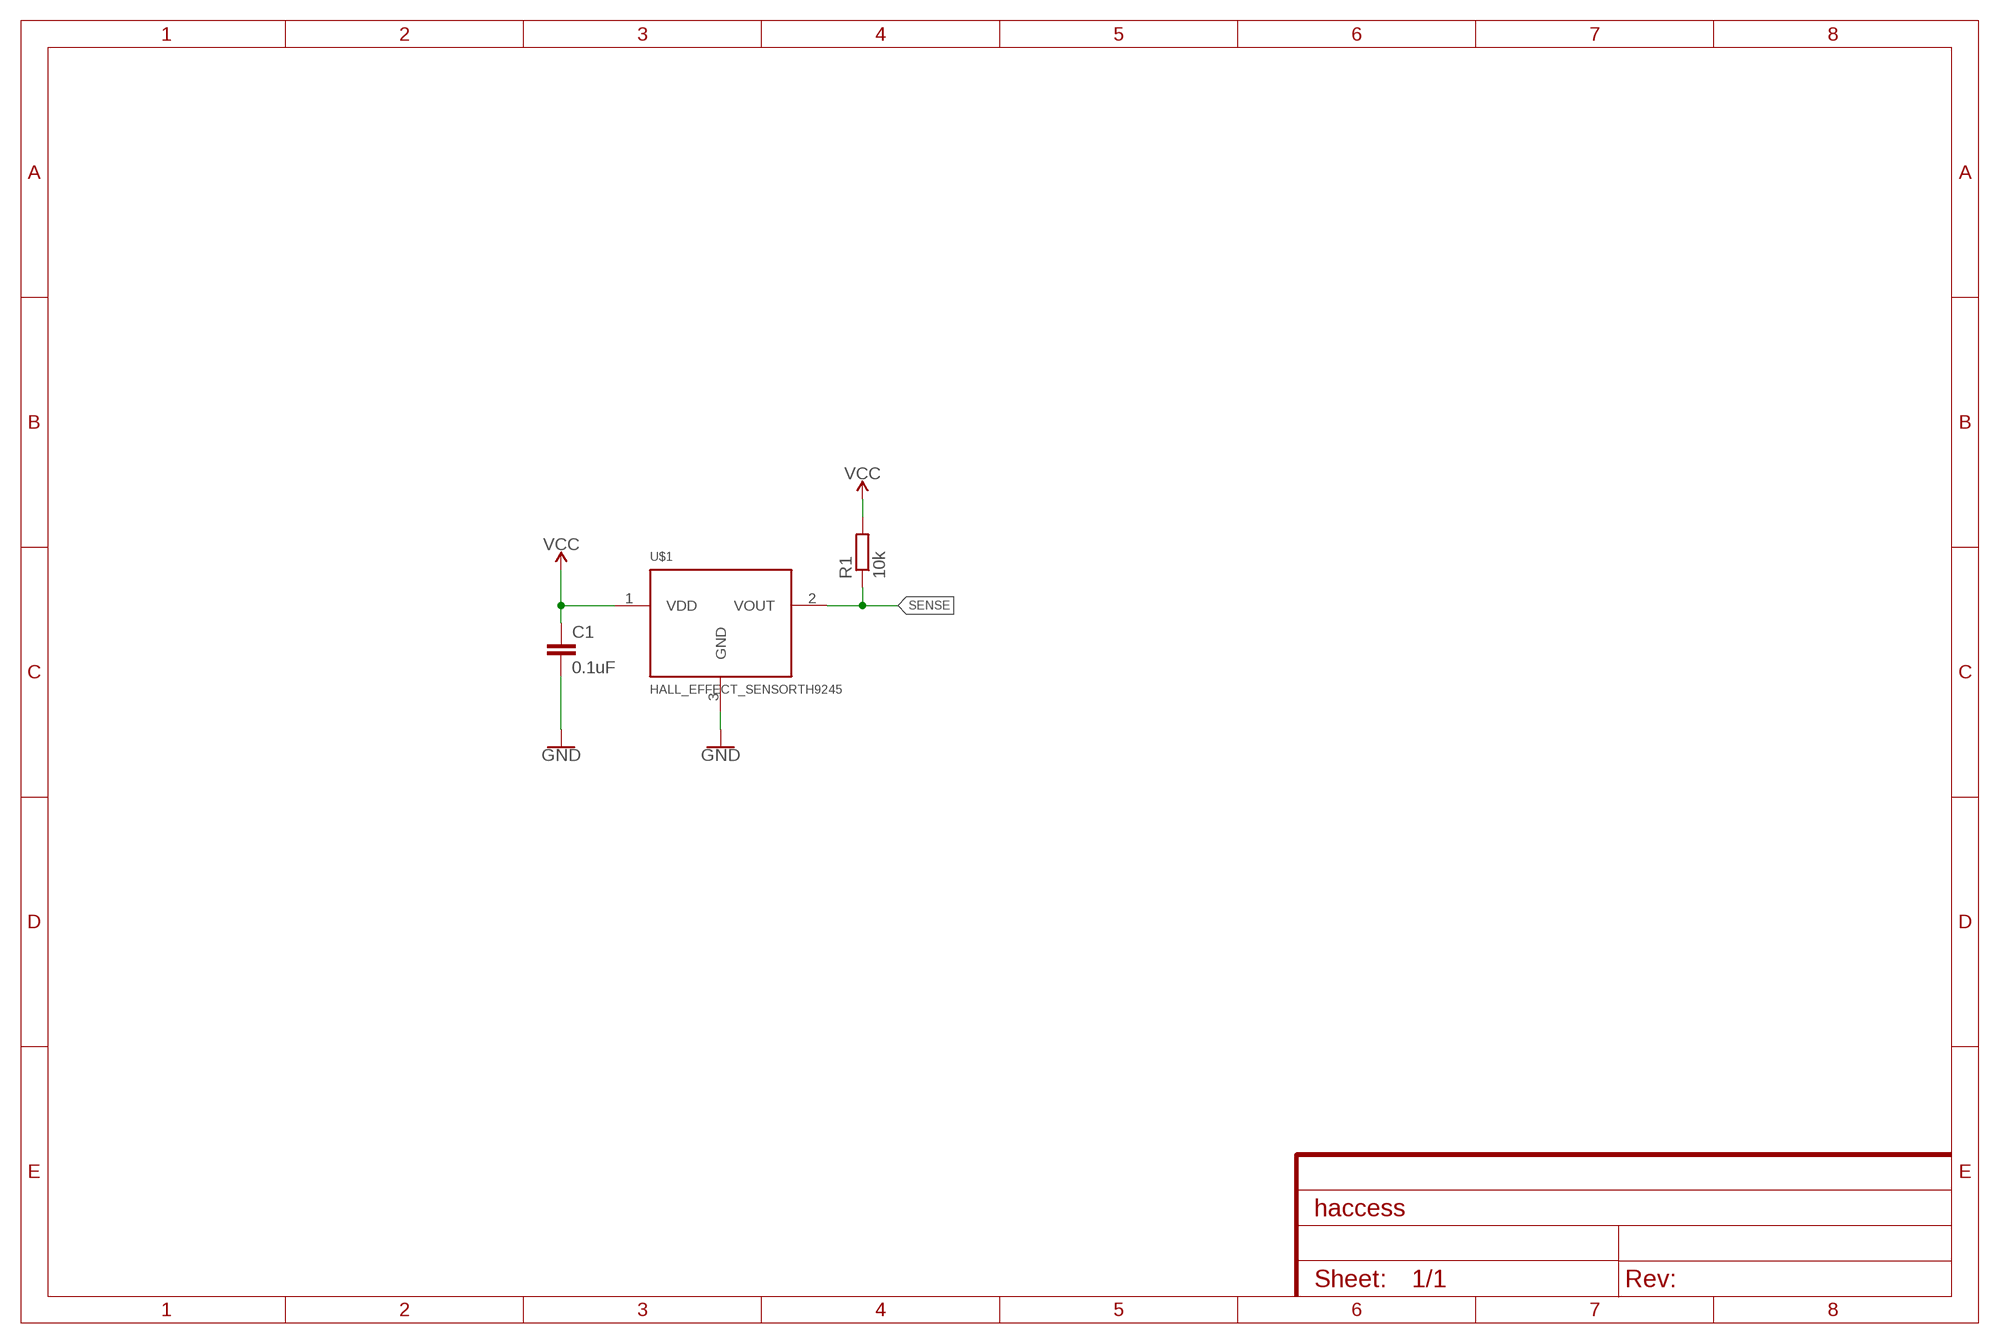
[diagram p9: schematic, module HALL_EFFECT, sheet 1]

### Parts
C1  0.1uF  C-EUC0603  [C0603]
R1  10k  R-EU_R0603  [R0603]
U$1  HALL_EFFECT_SENSORTH9245  [SOT23-3]

### Nets
GND: C1.2 U$1.3(GND)
SENSE: R1.1 U$1.2(VOUT)
VCC: C1.1 R1.2 U$1.1(VDD)

### Library data of the parts
C1 = rcl:C-EU: CAPACITOR, European symbol; SPICEPREFIX: C
R1 = rcl:R-EU_: RESISTOR, European symbol; SPICEPREFIX: R
U$1 = pinebook_parts:HALL_EFFECT_SENSOR

## Module EEPROM
Ports: VCC(pwr) GND(pwr) SDA(io) SCL(in)
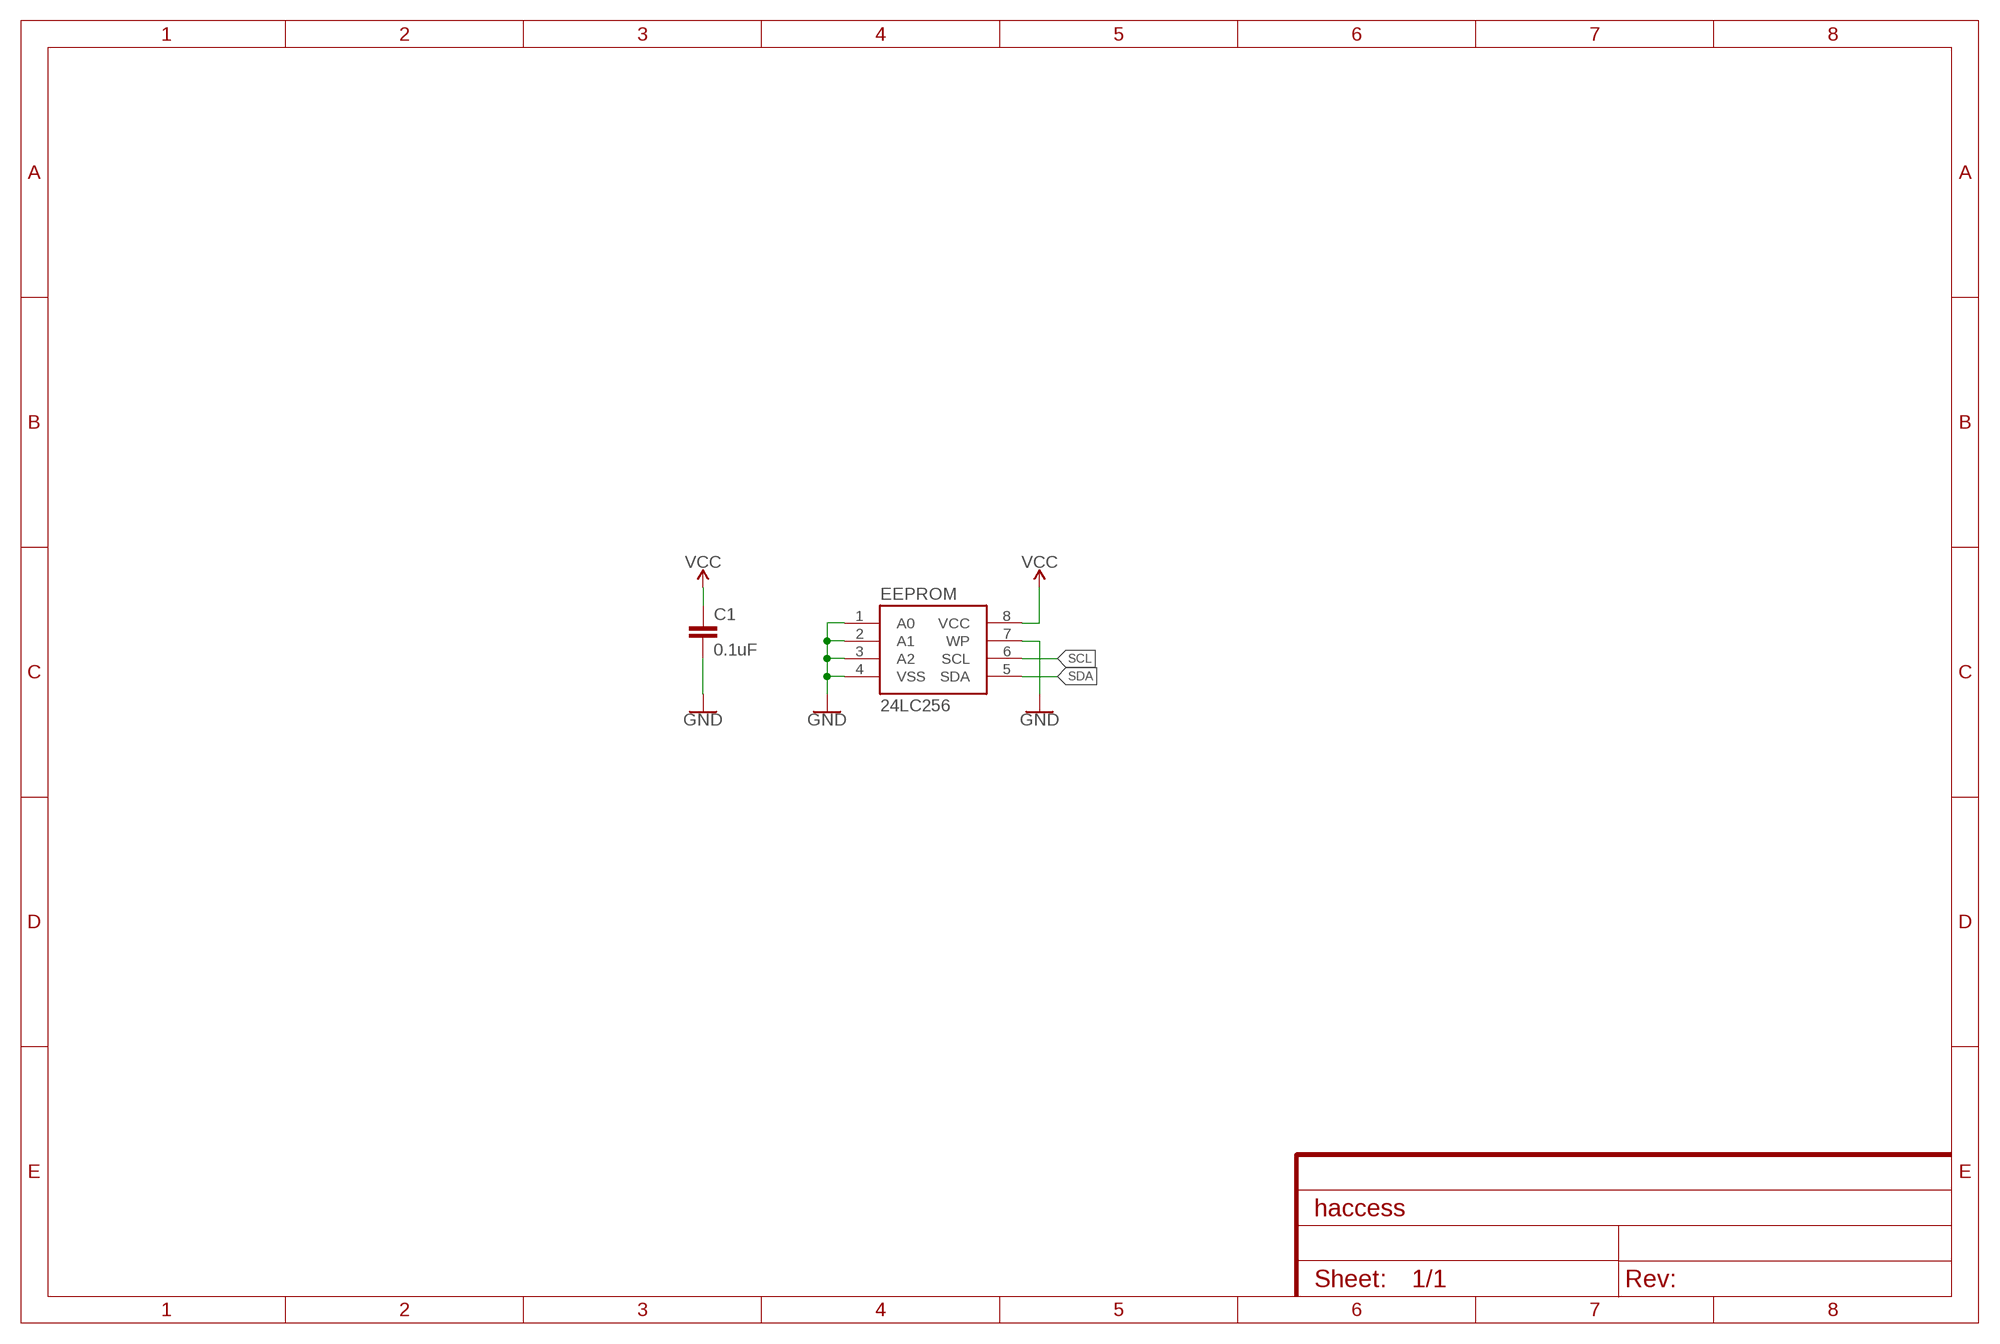
[diagram p10: schematic, module EEPROM, sheet 1]

### Parts
C1  0.1uF  C-EUC0603  [C0603]
EEPROM  24LC256  EEPROM-I2CSMD  [SO08]

### Nets
GND: C1.2 EEPROM.1(A0) EEPROM.2(A1) EEPROM.3(A2) EEPROM.4(VSS) EEPROM.7(WP)
SCL: EEPROM.6(SCL)
SDA: EEPROM.5(SDA)
VCC: C1.1 EEPROM.8(VCC)

### Library data of the parts
C1 = rcl:C-EU: CAPACITOR, European symbol; SPICEPREFIX: C
EEPROM = SparkFun-IC-Memory:EEPROM-I2C: I2C EEPROMs, 24LC256 and others 24LC256 Series 256 kb I2C 2 Wire (32 k x 8 Bit) 2.5 V Serial EEPROM SMD - SOIC-8 Datasheet SparkFun Products SparkFun UDB5 - PIC UAV Development Board <https://www.sparkfun.com/products/11703> (GPS-11703); PROD_ID: IC-09714

## Module USB_A
Ports: D+(in) D-(in) GND(pwr) 5V(pwr) EN(in)
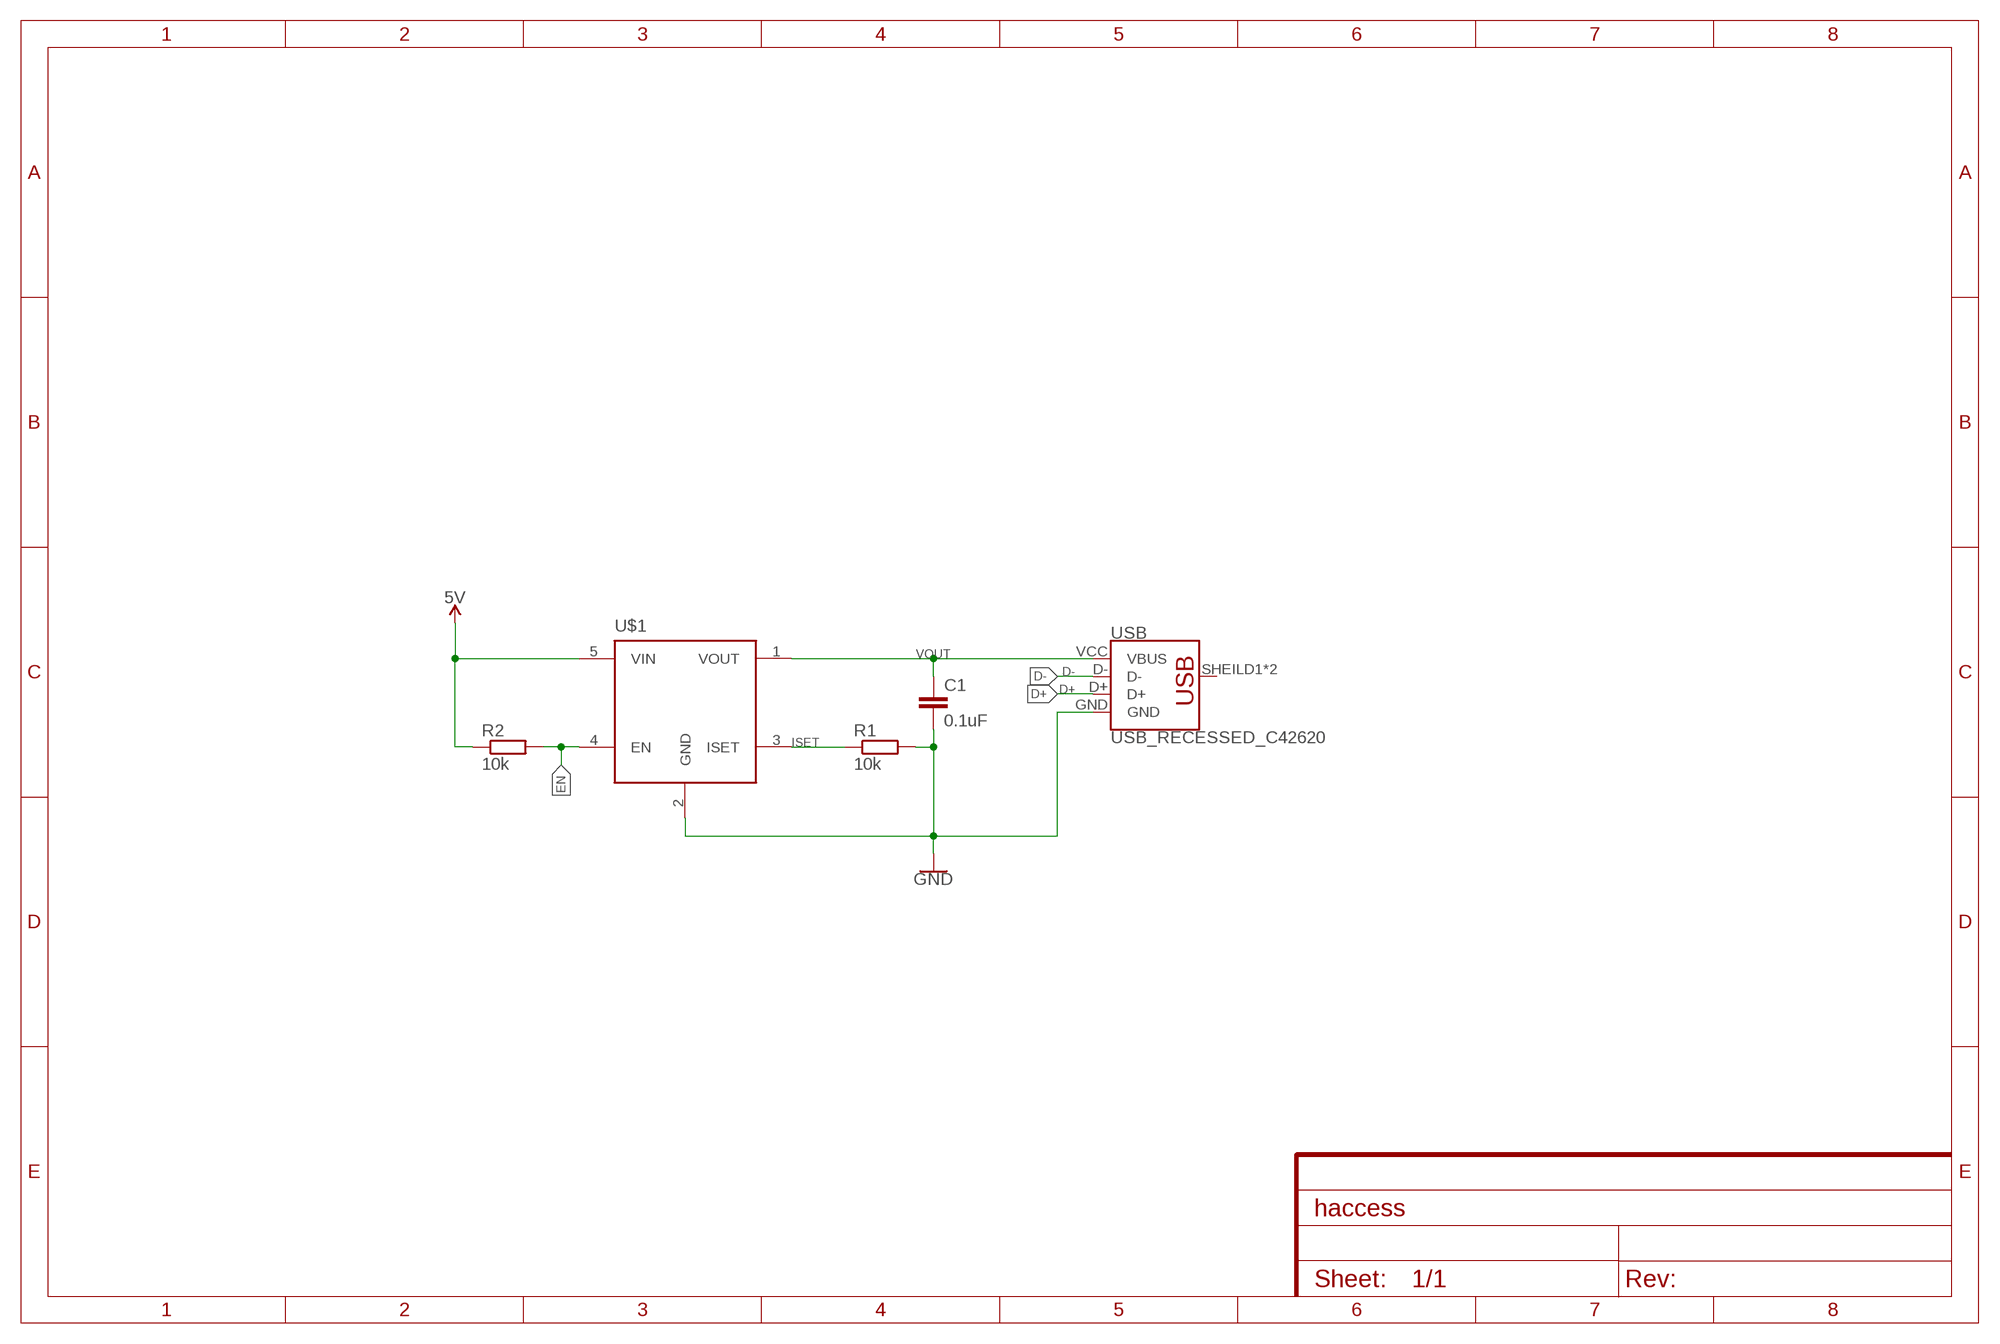
[diagram p11: schematic, module USB_A, sheet 1]

### Parts
C1  0.1uF  C-EUC0603  [C0603]
R1  10k  R-EU_R0603  [R0603]
R2  10k  R-EU_R0603  [R0603]
U$1  CURRENT-LIMITINGSY6280  [SOT23-5]
USB  USB_RECESSED_C42620  [USB_SOCKET_A_C42620]

### Nets
5V: R2.1 U$1.5(VIN)
D+: USB.D+
D-: USB.D-
EN: R2.2 U$1.4(EN)
GND: C1.2 R1.2 U$1.2(GND) USB.GND
ISET: R1.1 U$1.3(ISET)
VOUT: C1.1 U$1.1(VOUT) USB.VCC(VBUS)
Unconnected: USB.SHEILD1(SHIELD) USB.SHEILD2(SHIELD)

### Library data of the parts
C1 = rcl:C-EU: CAPACITOR, European symbol; SPICEPREFIX: C
R1 R2 = rcl:R-EU_: RESISTOR, European symbol; SPICEPREFIX: R
U$1 = pinebook_parts:CURRENT-LIMITING
USB = pinebook_parts:USB_RECESSED_C42620

## Module PINEBOOK_EXPANSION_FFC
Ports: 5V(pwr) 3.3V(pwr) GND(pwr) SDA(io) SCL(in) GPIO_0(io) GPIO_1(io) GPIO_2(io) GPIO_3(io) USB_A_D+(io) USB_A_D-(io) USB_B_D+(io) USB_B_D-(io) EN(in)
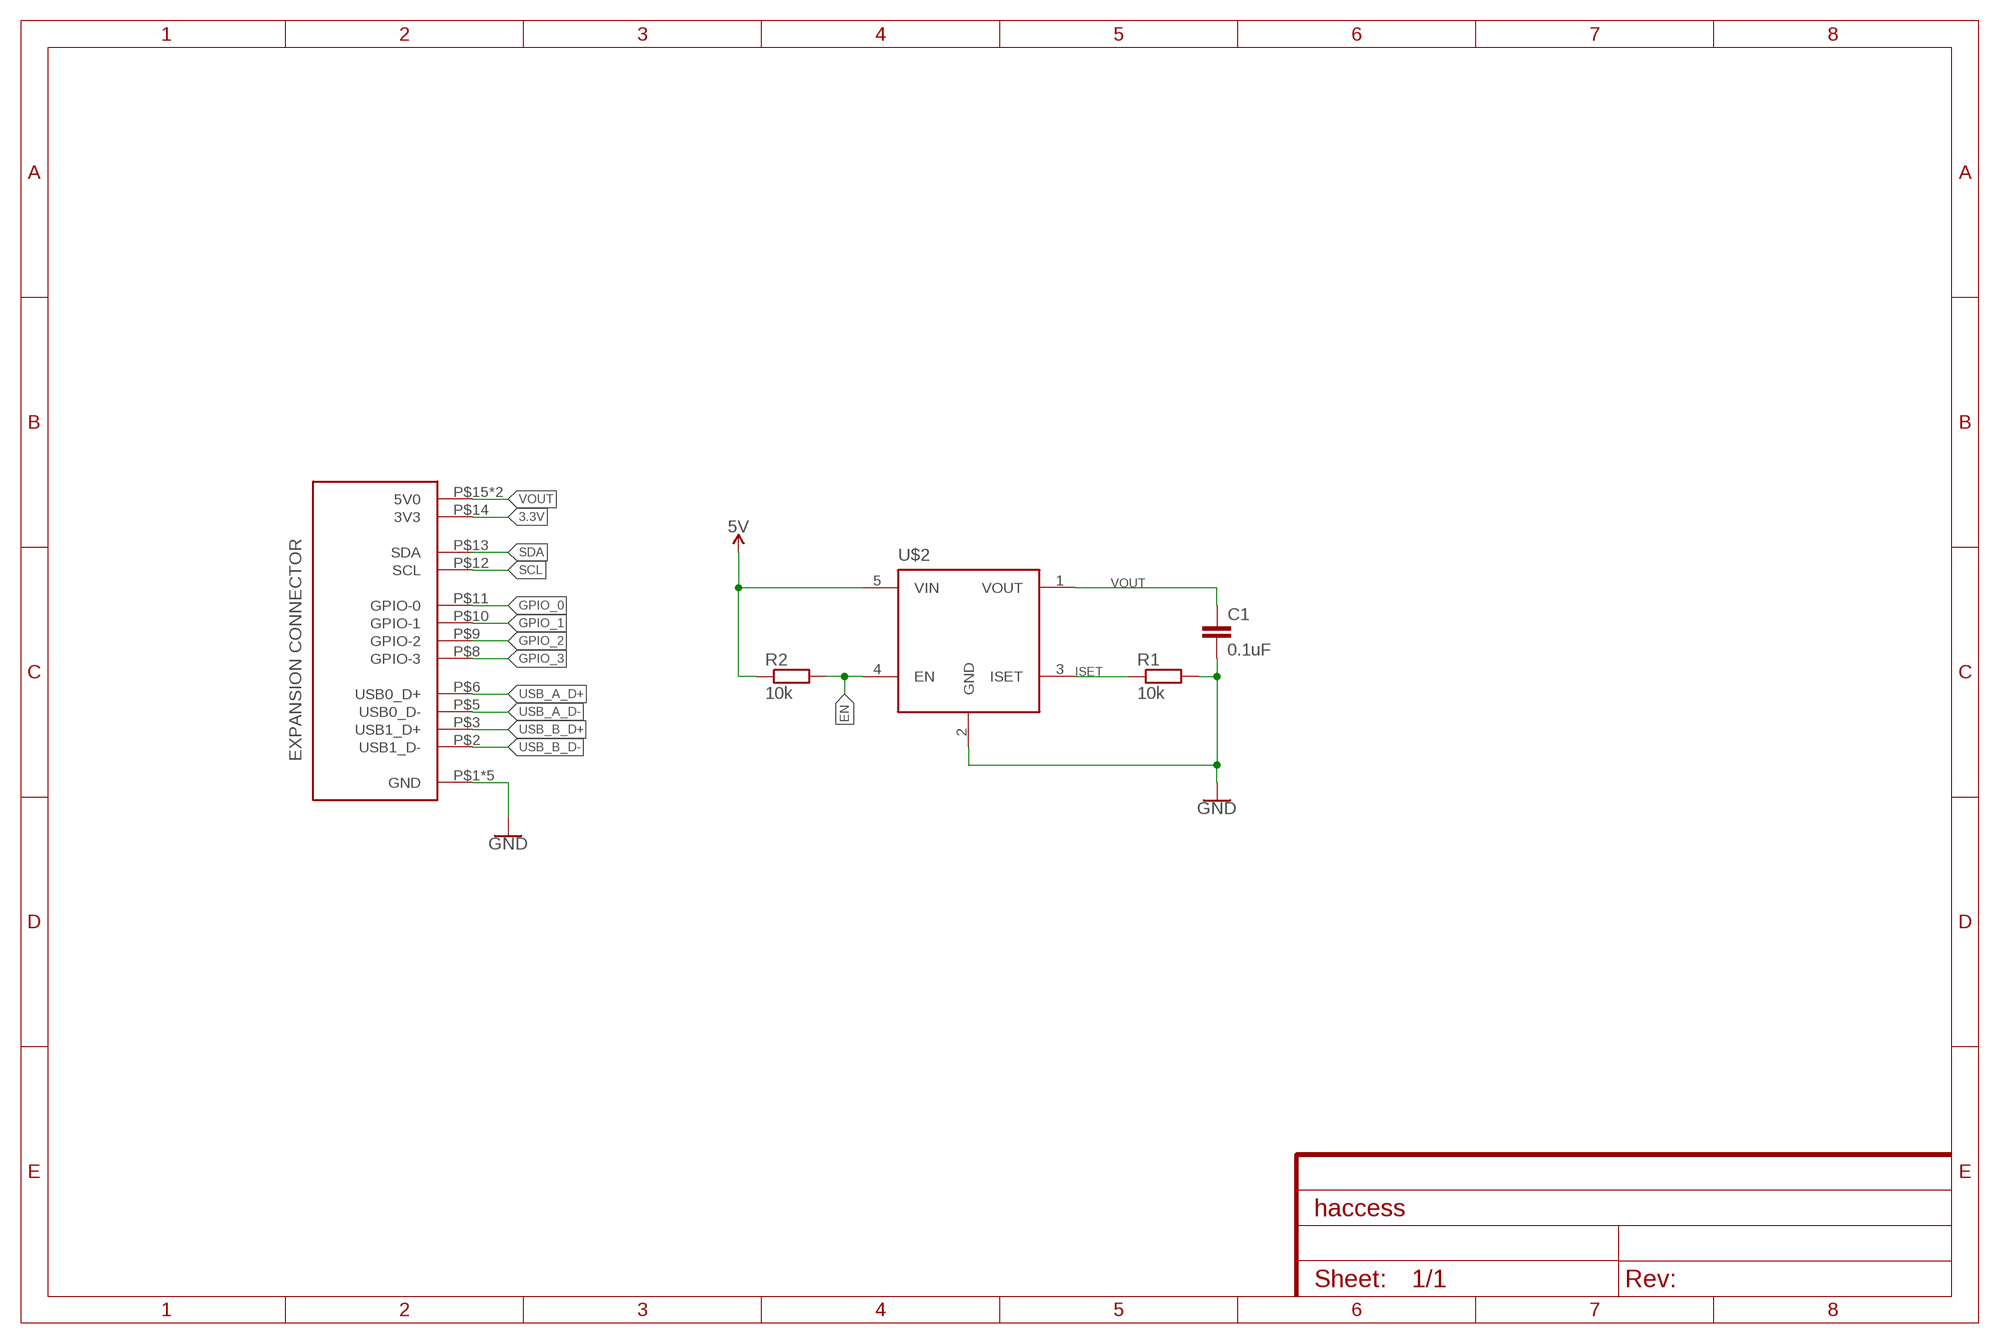
[diagram p12: schematic, module PINEBOOK_EXPANSION_FFC, sheet 1]

### Parts
C1  0.1uF  C-EUC0603  [C0603]
R1  10k  R-EU_R0603  [R0603]
R2  10k  R-EU_R0603  [R0603]
U$1  PINEBOOK-PRO-EXPANSION-CONNECTOR  [FPC-C528044]
U$2  CURRENT-LIMITINGSY6280  [SOT23-5]

### Nets
3.3V: U$1.P$14(3V3)
5V: R2.1 U$2.5(VIN)
EN: R2.2 U$2.4(EN)
GND: C1.2 R1.2 U$1.P$1(GND) U$1.P$4(GND) U$1.P$7(GND) U$1.SHIELD1(GND) U$1.SHIELD2(GND) U$2.2(GND)
GPIO_0: U$1.P$11(GPIO-0)
GPIO_1: U$1.P$10(GPIO-1)
GPIO_2: U$1.P$9(GPIO-2)
GPIO_3: U$1.P$8(GPIO-3)
ISET: R1.1 U$2.3(ISET)
SCL: U$1.P$12(SCL)
SDA: U$1.P$13(SDA)
USB_A_D+: U$1.P$6(USB0_D+)
USB_A_D-: U$1.P$5(USB0_D-)
USB_B_D+: U$1.P$3(USB1_D+)
USB_B_D-: U$1.P$2(USB1_D-)
VOUT: C1.1 U$1.P$15(5V0) U$1.P$16(5V0) U$2.1(VOUT)

### Library data of the parts
C1 = rcl:C-EU: CAPACITOR, European symbol; SPICEPREFIX: C
R1 R2 = rcl:R-EU_: RESISTOR, European symbol; SPICEPREFIX: R
U$1 = pinebook_parts:PINEBOOK-PRO-EXPANSION-CONNECTOR
U$2 = pinebook_parts:CURRENT-LIMITING

## Net classes
1 pwr: width 0.305 mm